# EAGLE design testerusb (EAGLE 9.6.2)
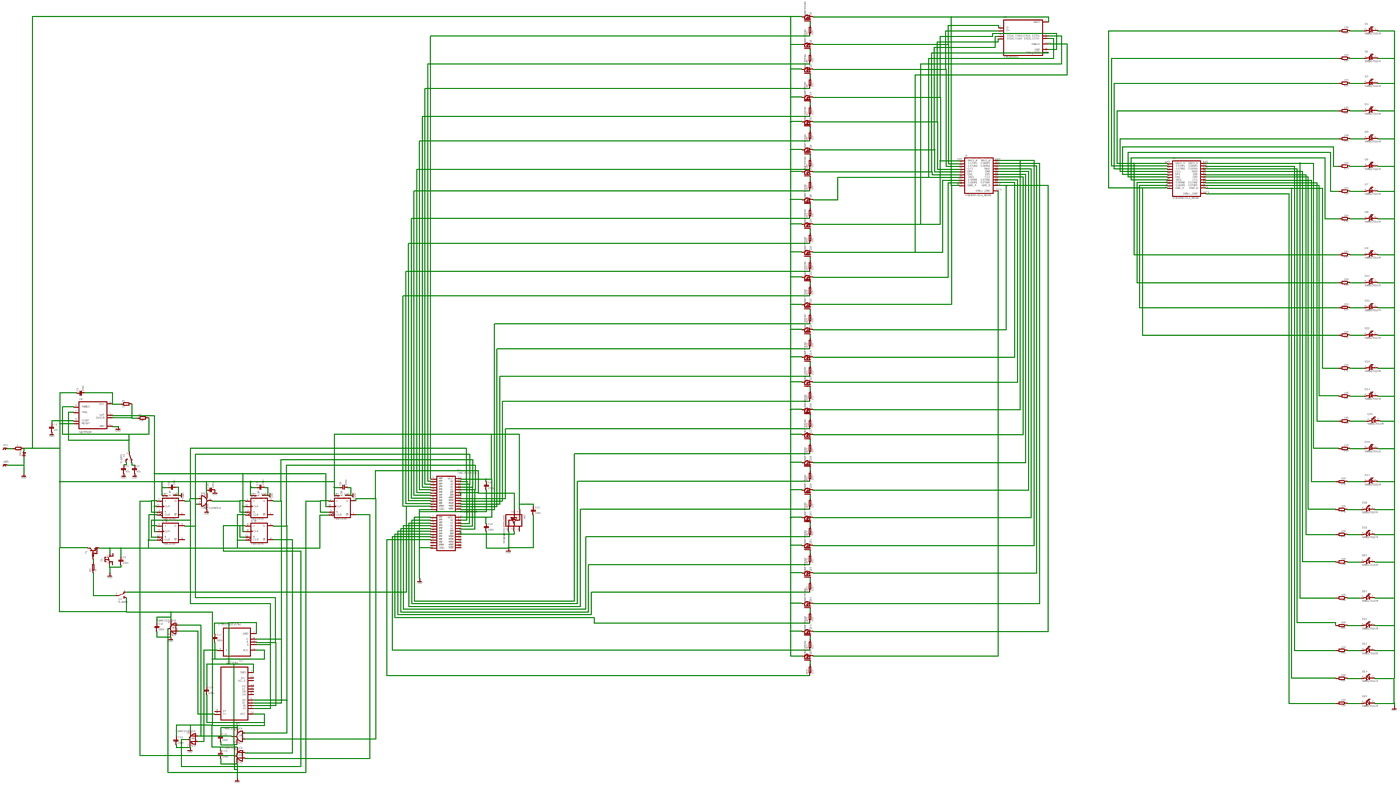
[diagram p0: schematic, sheet 1, overview]
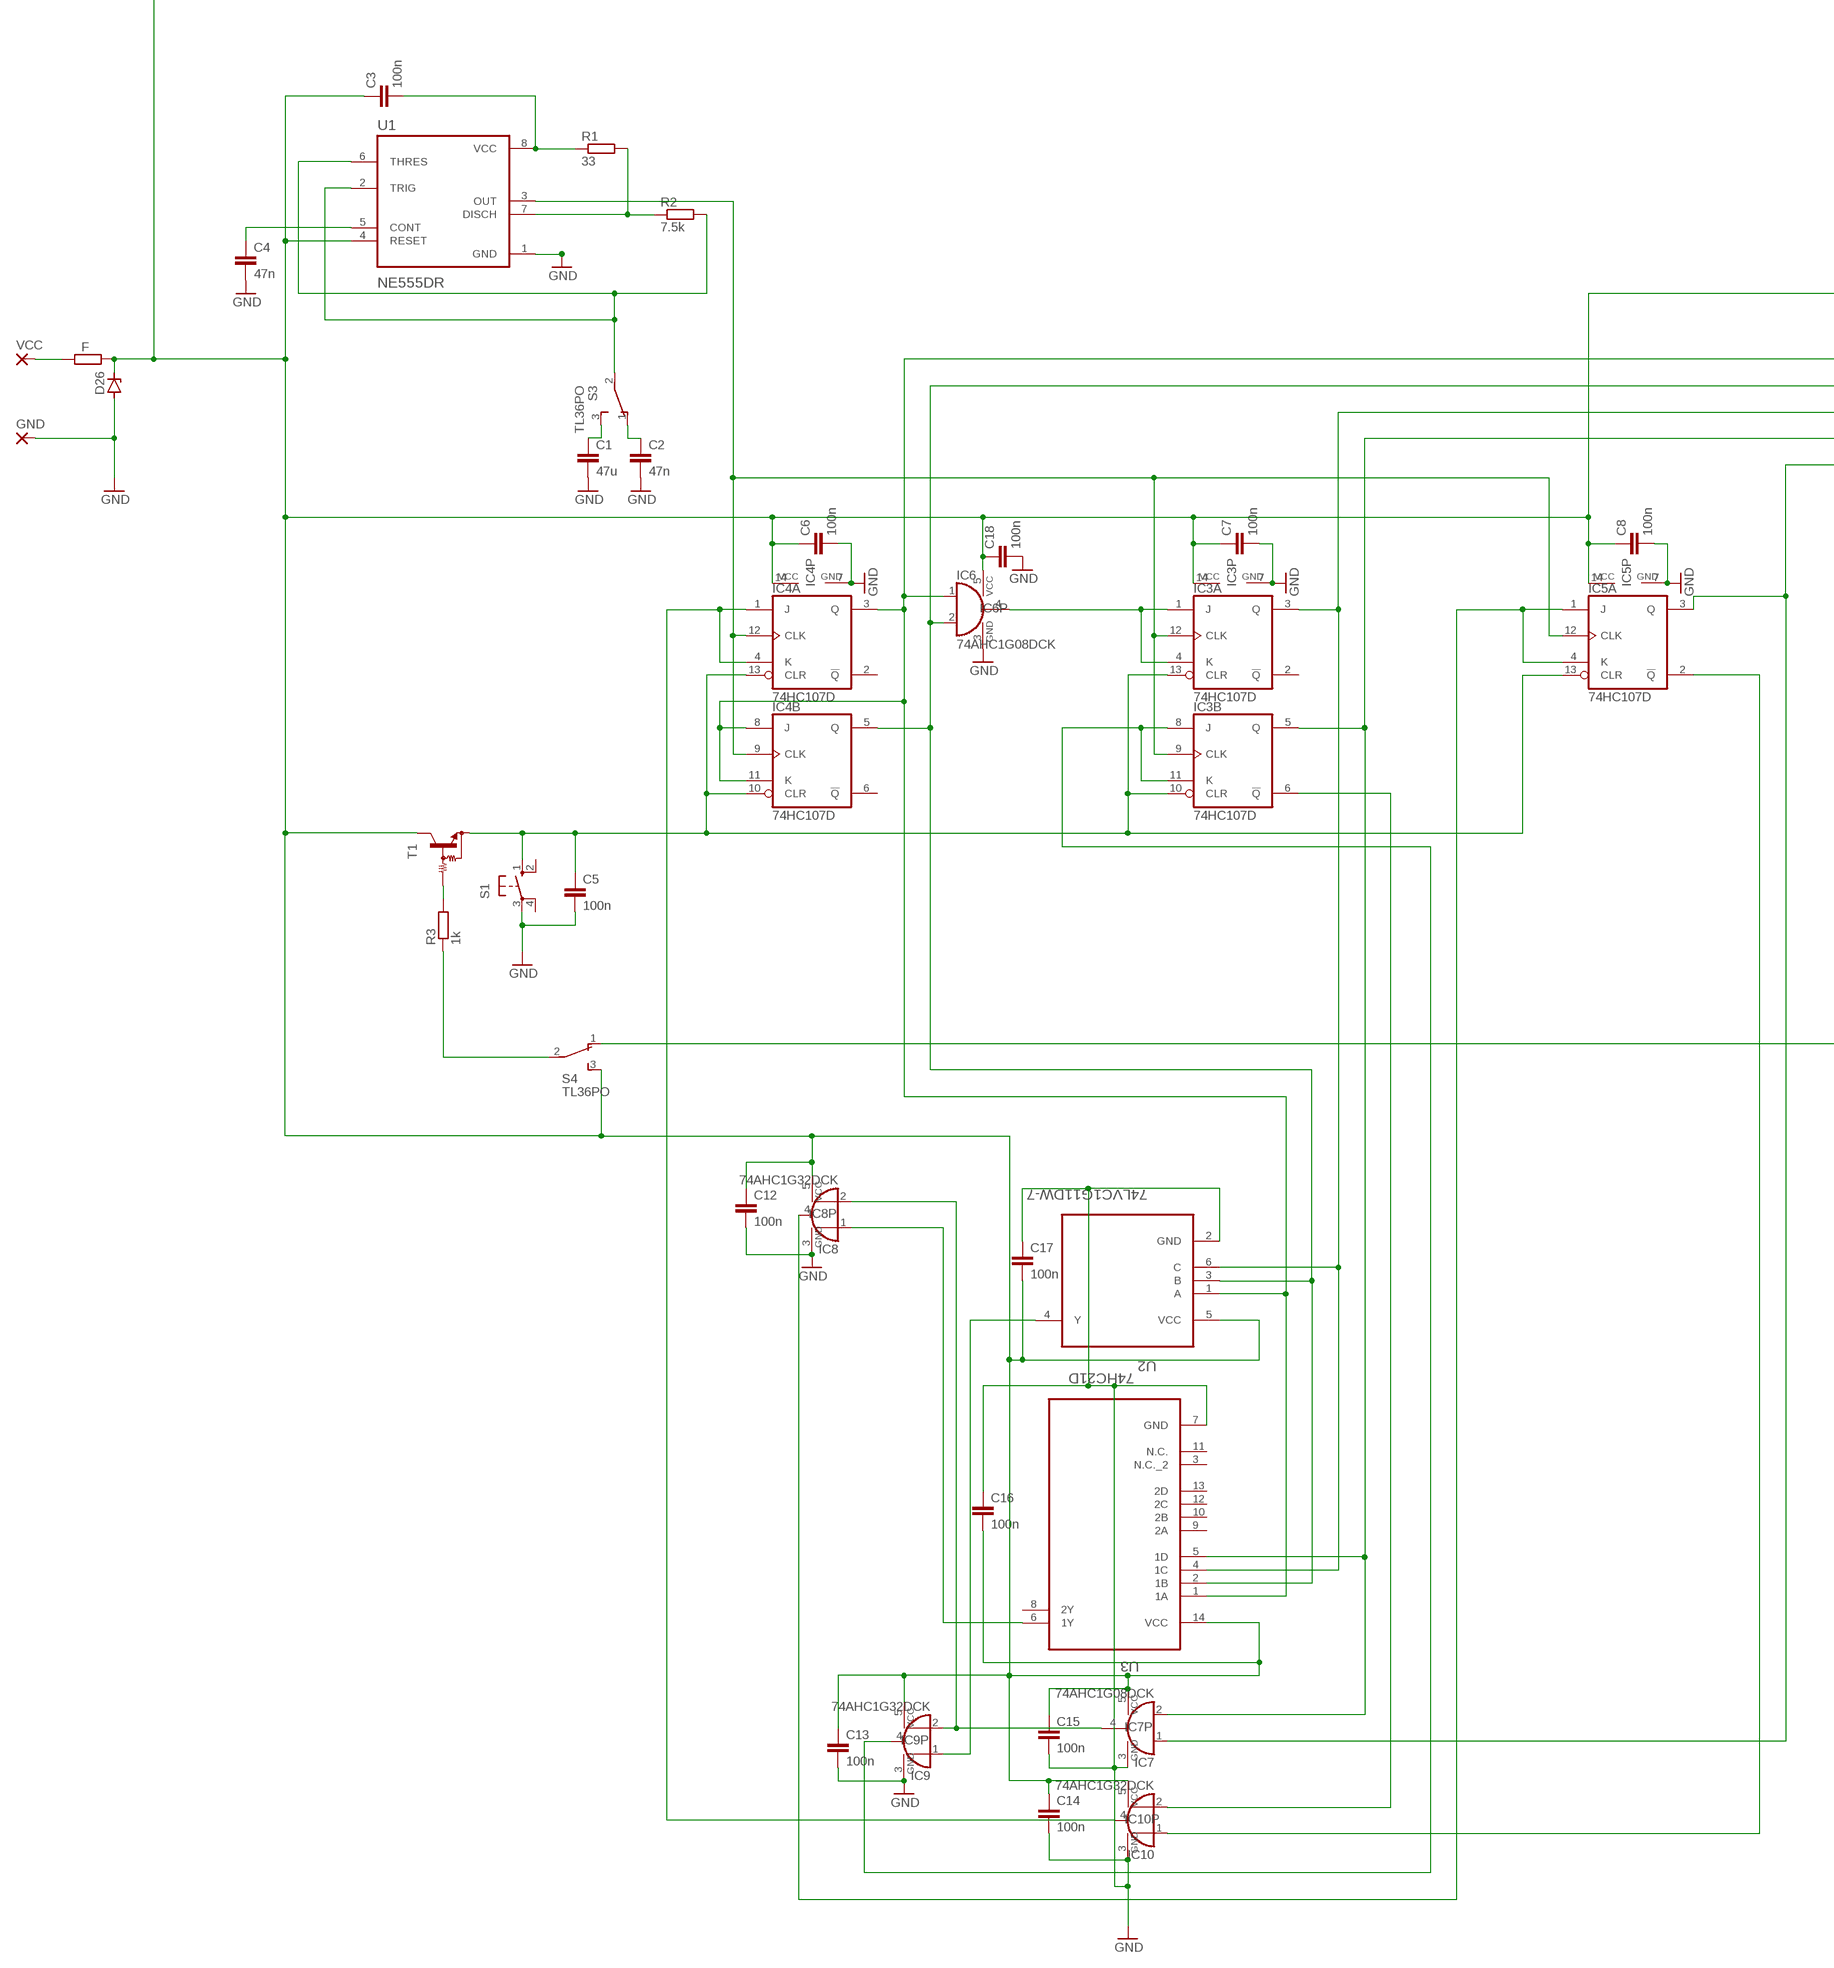
[diagram p1: schematic, sheet 1, part 1 of 6]
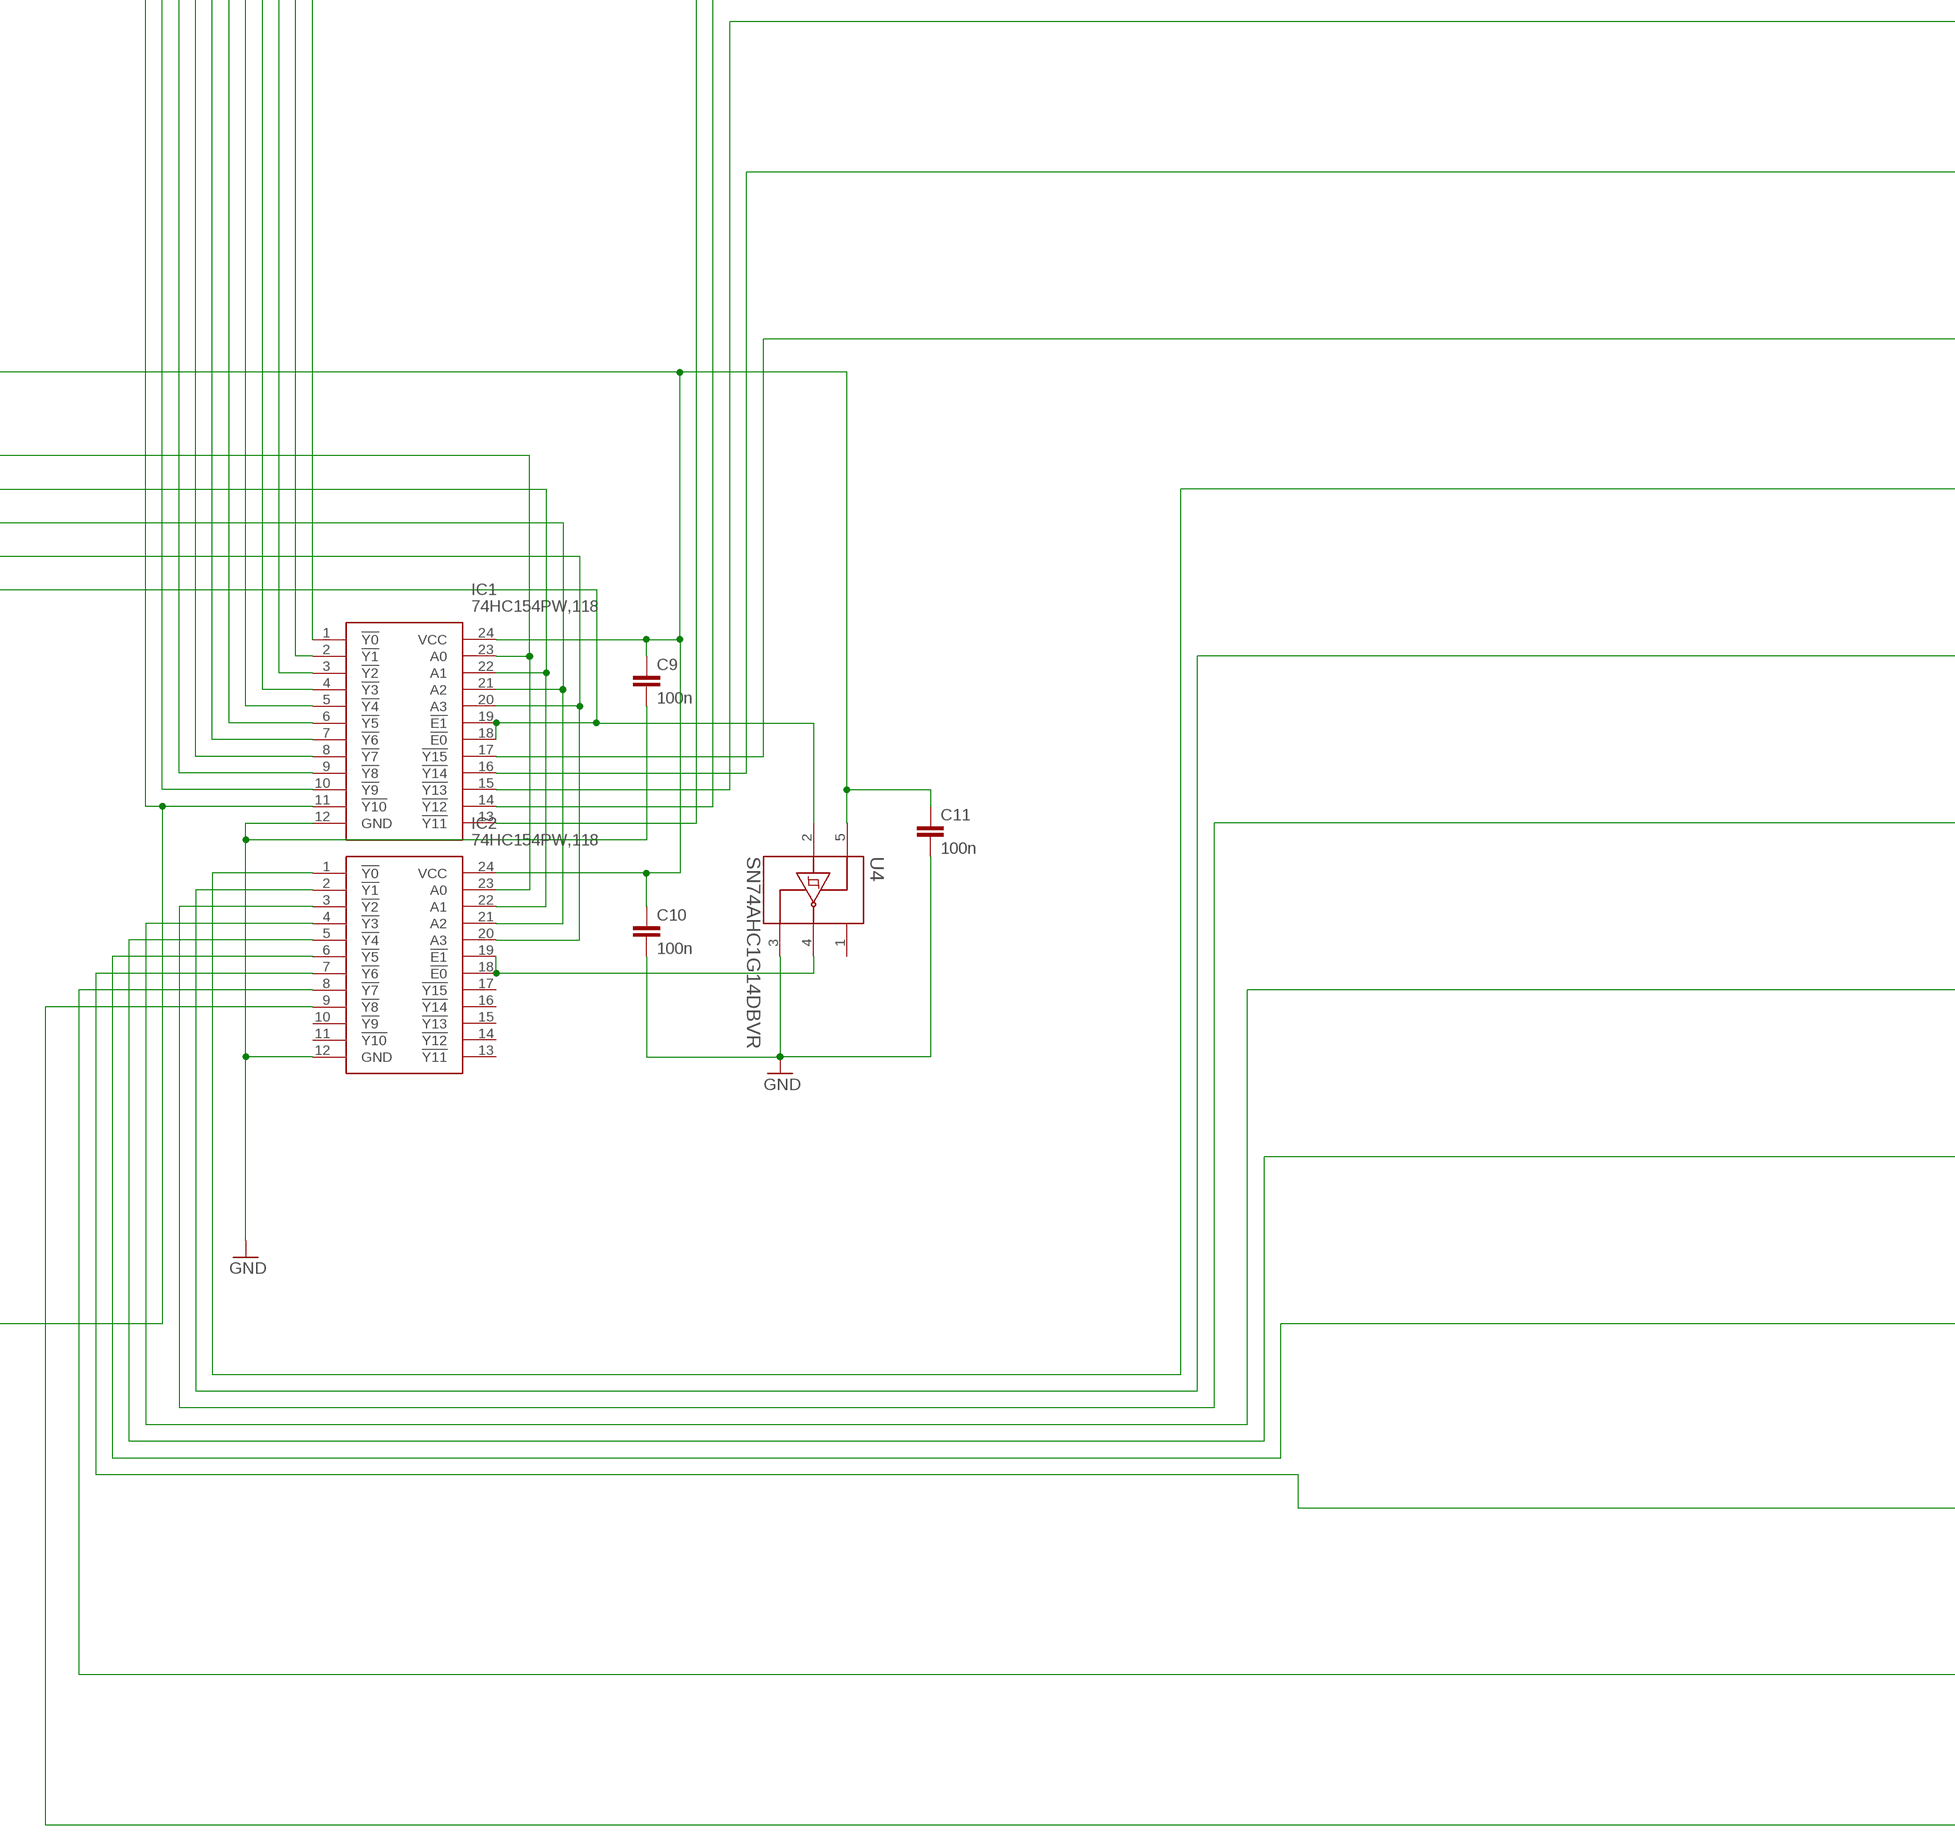
[diagram p2: schematic, sheet 1, part 2 of 6]
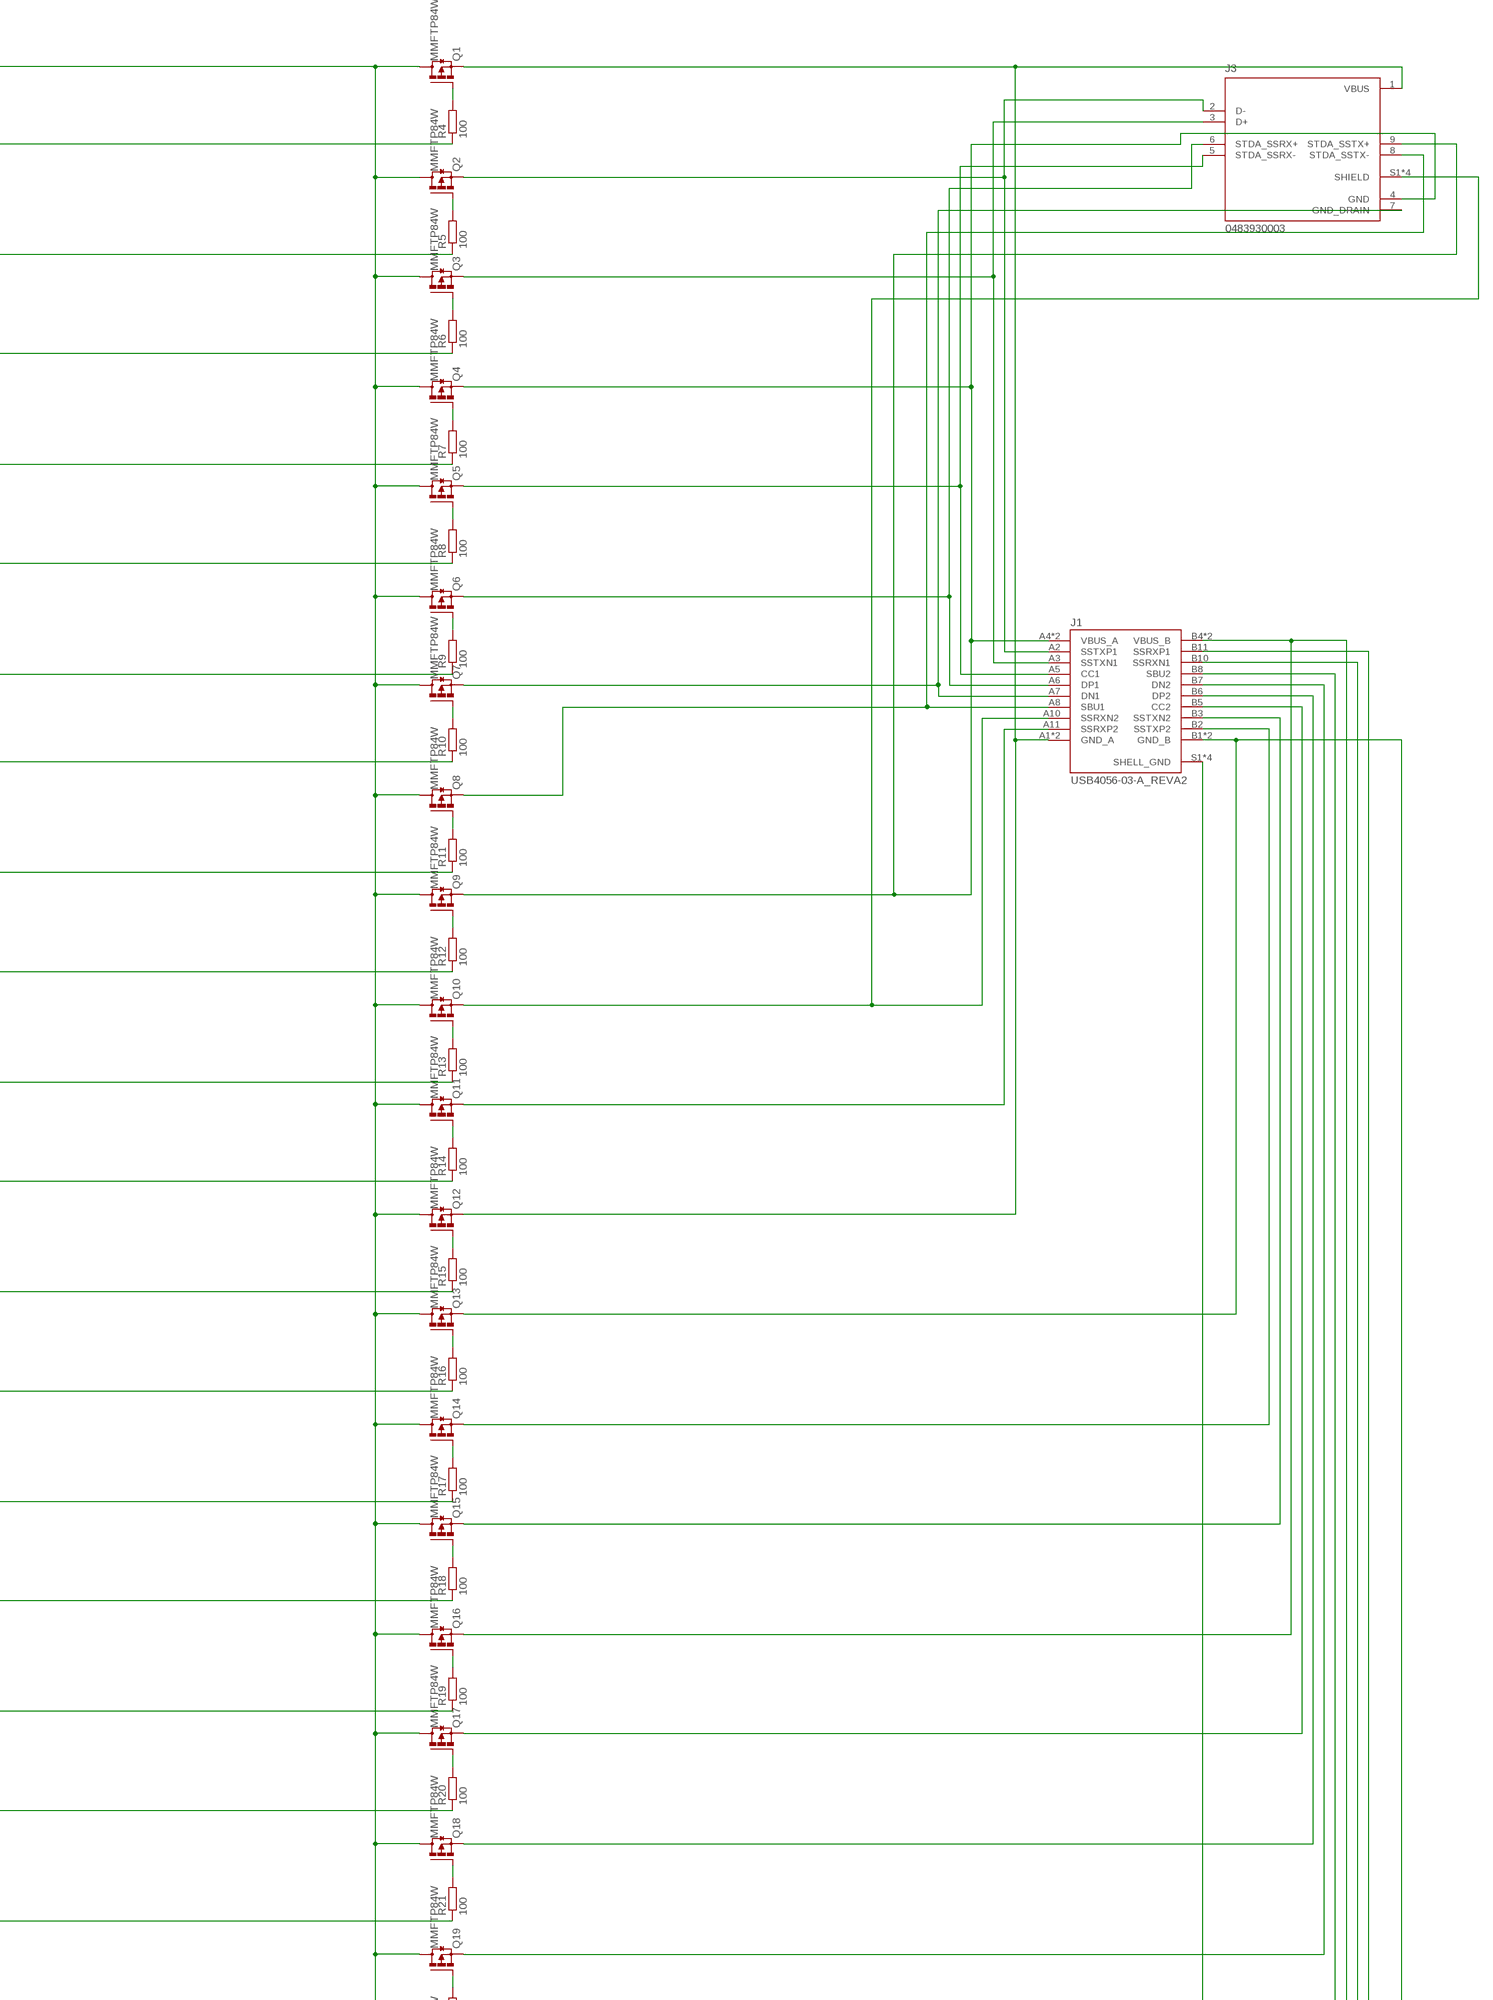
[diagram p3: schematic, sheet 1, part 3 of 6]
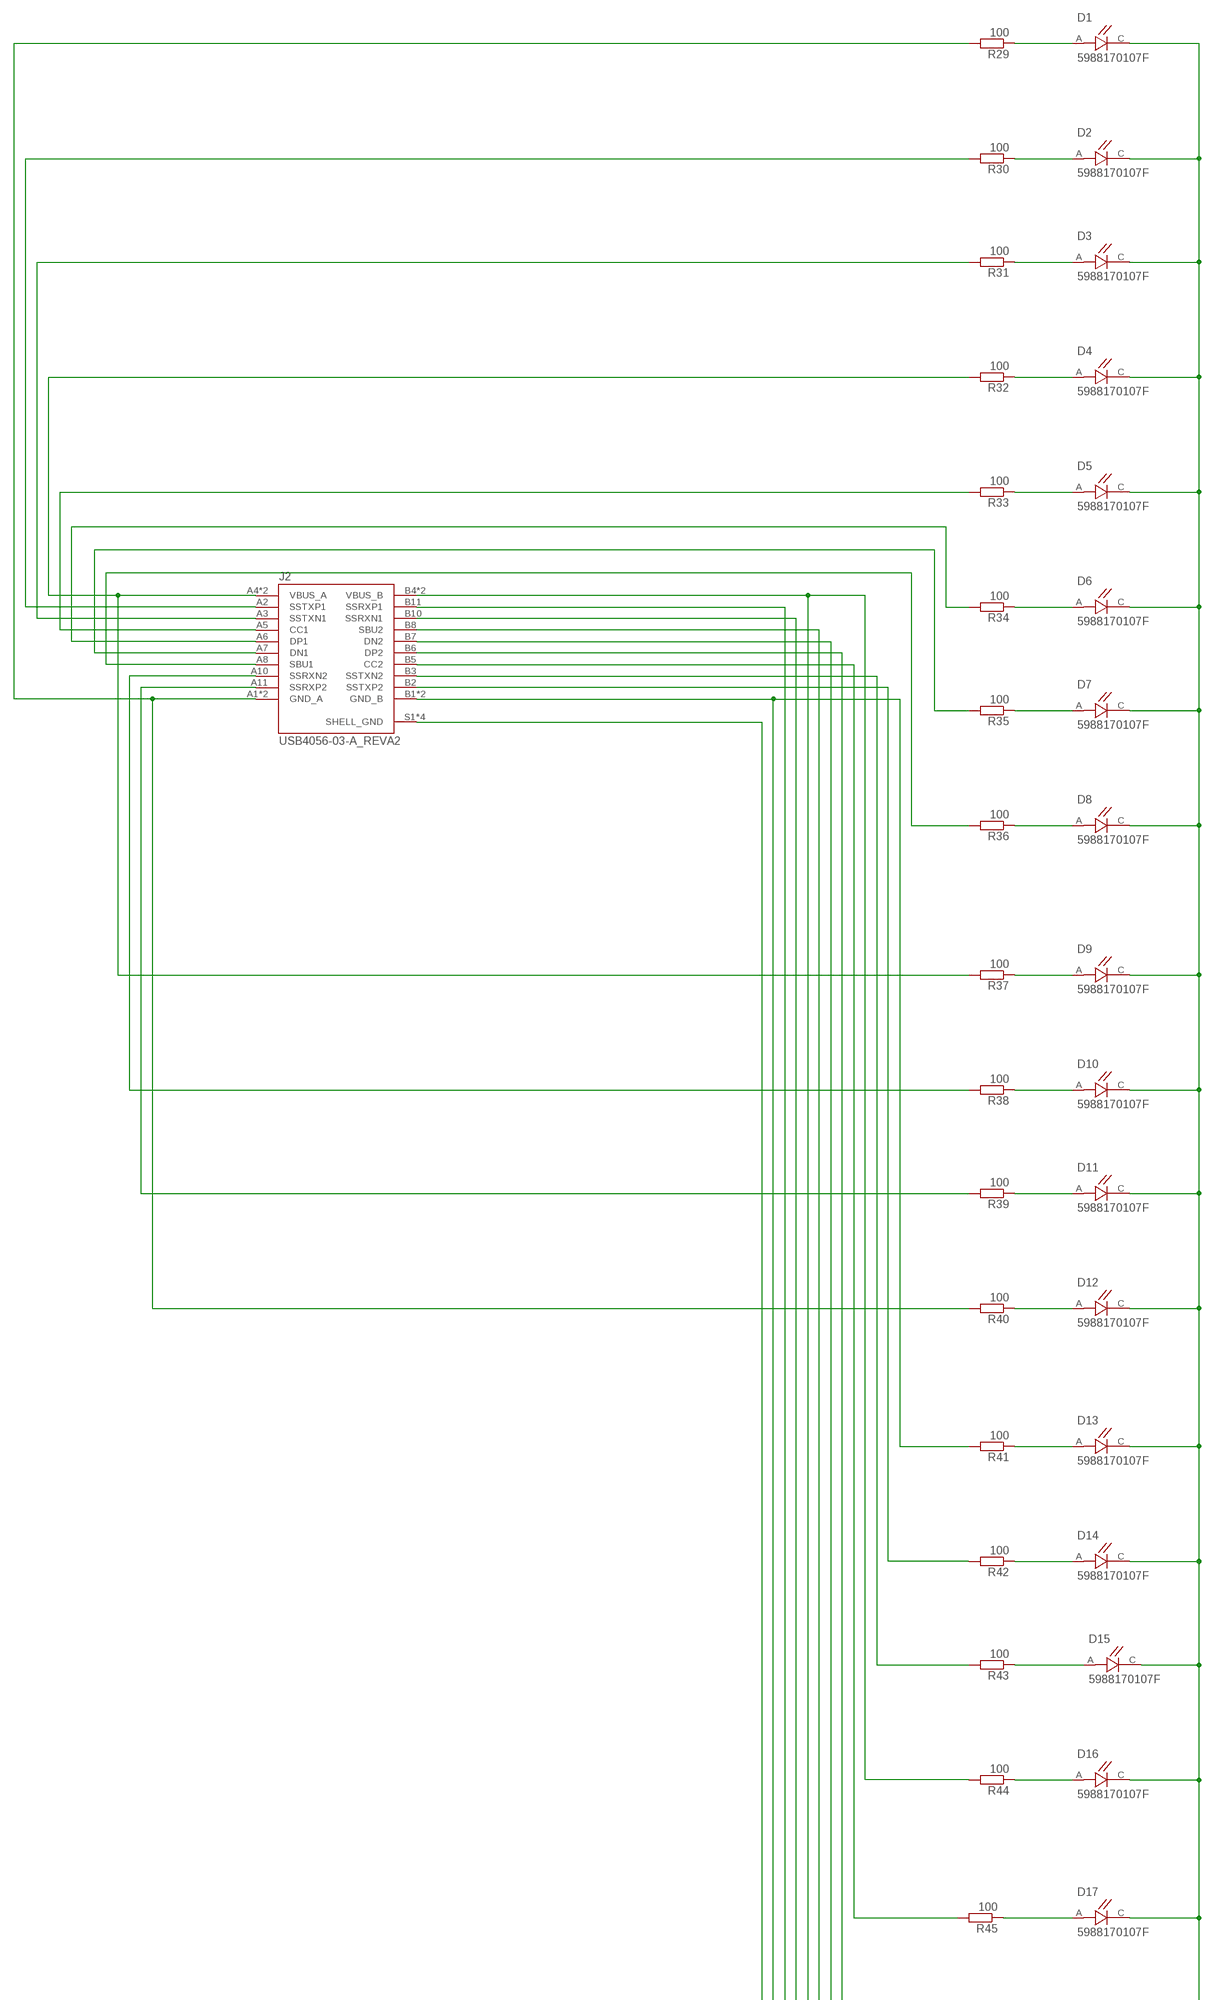
[diagram p4: schematic, sheet 1, part 4 of 6]
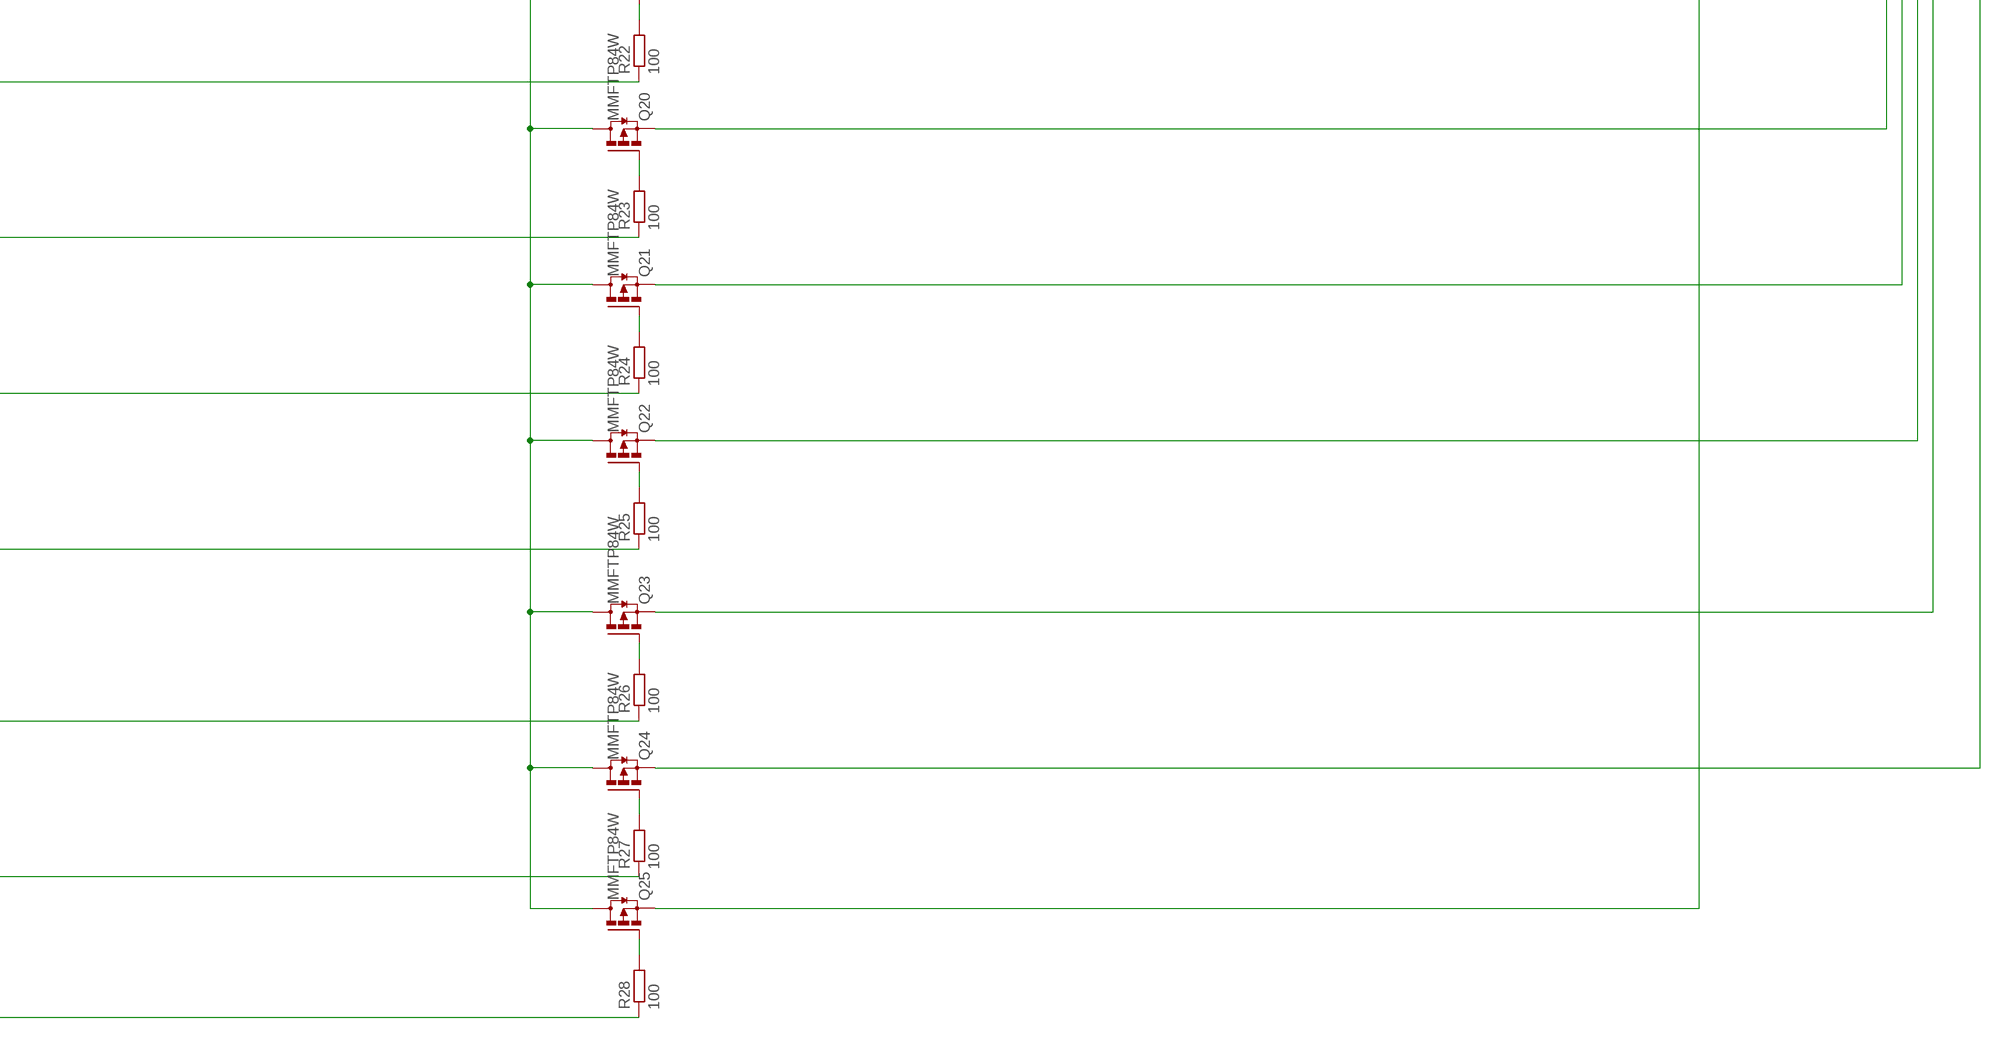
[diagram p5: schematic, sheet 1, part 5 of 6]
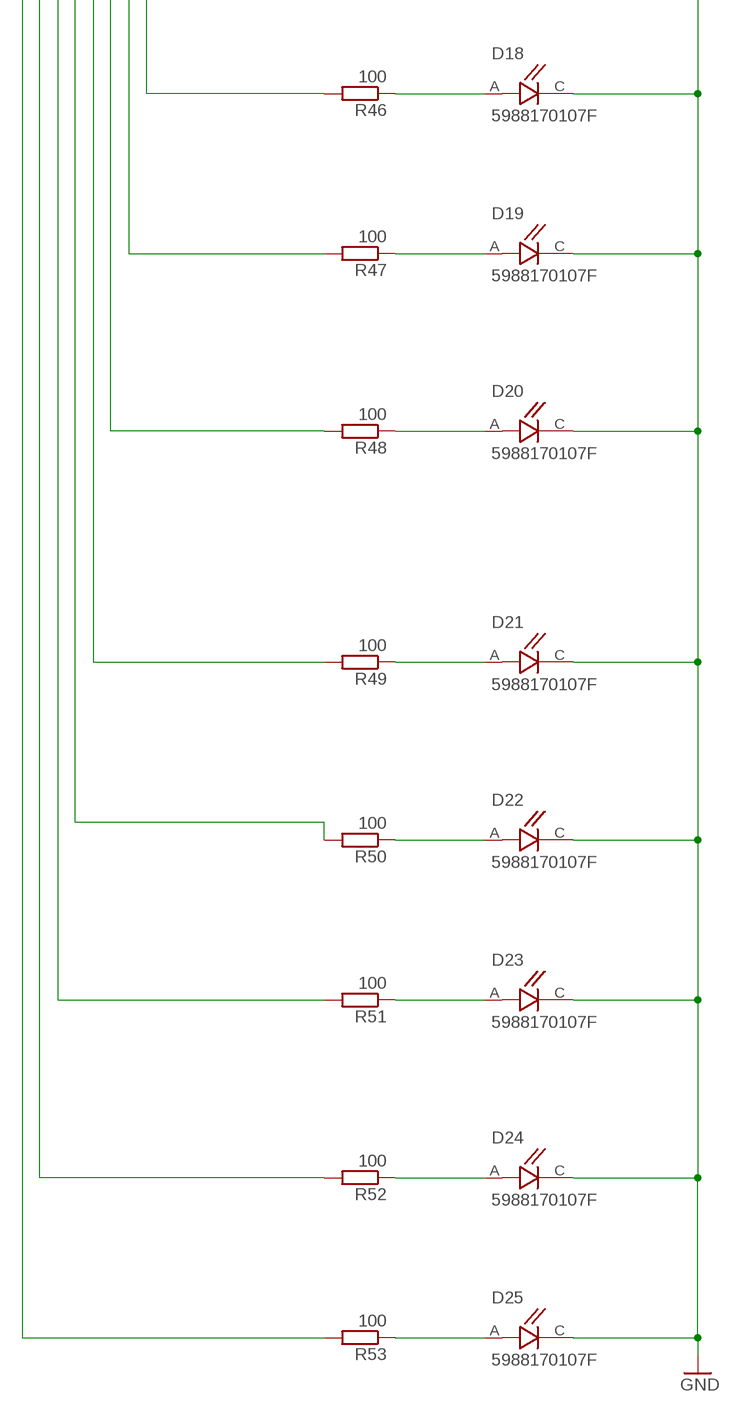
[diagram p6: schematic, sheet 1, part 6 of 6]

## Parts
C1  47u  C-EU025_050-035X075  [C025_050-035X075]
C2  47n  C-EU025_050-035X075  [C025_050-035X075]
C3  100n  C-EUC0805  [C0805]
C4  47n  C-EU025_050-035X075  [C025_050-035X075]
C5  100n  C-EUC0805  [C0805]
C6  100n  C-EUC0805  [C0805]
C7  100n  C-EUC0805  [C0805]
C8  100n  C-EUC0805  [C0805]
C9  100n  C-EUC0805  [C0805]
C10  100n  C-EUC0805  [C0805]
C11  100n  C-EUC0805  [C0805]
C12  100n  C-EUC0805  [C0805]
C13  100n  C-EUC0805  [C0805]
C14  100n  C-EUC0805  [C0805]
C15  100n  C-EUC0805  [C0805]
C16  100n  C-EUC0805  [C0805]
C17  100n  C-EUC0805  [C0805]
C18  100n  C-EUC0805  [C0805]
D1  5988170107F  [LEDC2012X70N]
D2  5988170107F  [LEDC2012X70N]
D3  5988170107F  [LEDC2012X70N]
D4  5988170107F  [LEDC2012X70N]
D5  5988170107F  [LEDC2012X70N]
D6  5988170107F  [LEDC2012X70N]
D7  5988170107F  [LEDC2012X70N]
D8  5988170107F  [LEDC2012X70N]
D9  5988170107F  [LEDC2012X70N]
D10  5988170107F  [LEDC2012X70N]
D11  5988170107F  [LEDC2012X70N]
D12  5988170107F  [LEDC2012X70N]
D13  5988170107F  [LEDC2012X70N]
D14  5988170107F  [LEDC2012X70N]
D15  5988170107F  [LEDC2012X70N]
D16  5988170107F  [LEDC2012X70N]
D17  5988170107F  [LEDC2012X70N]
D18  5988170107F  [LEDC2012X70N]
D19  5988170107F  [LEDC2012X70N]
D20  5988170107F  [LEDC2012X70N]
D21  5988170107F  [LEDC2012X70N]
D22  5988170107F  [LEDC2012X70N]
D23  5988170107F  [LEDC2012X70N]
D24  5988170107F  [LEDC2012X70N]
D25  5988170107F  [LEDC2012X70N]
D26  ZENER-DIODEP1-12  [P1Z12]
F  R-EU_1812X7R  [1812X7R]
GND  3,81/1,4  [3,81/1,4]
IC1  74HC154PW,118  [SOP65P640X110-24N]
IC2  74HC154PW,118  [SOP65P640X110-24N]
IC3  74HC107D  [SO14]
IC4  74HC107D  [SO14]
IC5  74HC107D  [SO14]
IC6  74AHC1G08DCK  [SC70-5]
IC7  74AHC1G08DCK  [SC70-5]
IC8  74AHC1G32DCK  [SC70-5]
IC9  74AHC1G32DCK  [SC70-5]
IC10  74AHC1G32DCK  [SC70-5]
J1  USB4056-03-A_REVA2  [GCT_USB4056-03-A_REVA2]
J2  USB4056-03-A_REVA2  [GCT_USB4056-03-A_REVA2]
J3  0483930003  [MOLEX_0483930003]
Q1  MMFTP84W  FDN360P  [SUPER-SOT3]
Q2  MMFTP84W  FDN360P  [SUPER-SOT3]
Q3  MMFTP84W  FDN360P  [SUPER-SOT3]
Q4  MMFTP84W  FDN360P  [SUPER-SOT3]
Q5  MMFTP84W  FDN360P  [SUPER-SOT3]
Q6  MMFTP84W  FDN360P  [SUPER-SOT3]
Q7  MMFTP84W  FDN360P  [SUPER-SOT3]
Q8  MMFTP84W  FDN360P  [SUPER-SOT3]
Q9  MMFTP84W  FDN360P  [SUPER-SOT3]
Q10  MMFTP84W  FDN360P  [SUPER-SOT3]
Q11  MMFTP84W  FDN360P  [SUPER-SOT3]
Q12  MMFTP84W  FDN360P  [SUPER-SOT3]
Q13  MMFTP84W  FDN360P  [SUPER-SOT3]
Q14  MMFTP84W  FDN360P  [SUPER-SOT3]
Q15  MMFTP84W  FDN360P  [SUPER-SOT3]
Q16  MMFTP84W  FDN360P  [SUPER-SOT3]
Q17  MMFTP84W  FDN360P  [SUPER-SOT3]
Q18  MMFTP84W  FDN360P  [SUPER-SOT3]
Q19  MMFTP84W  FDN360P  [SUPER-SOT3]
Q20  MMFTP84W  FDN360P  [SUPER-SOT3]
Q21  MMFTP84W  FDN360P  [SUPER-SOT3]
Q22  MMFTP84W  FDN360P  [SUPER-SOT3]
Q23  MMFTP84W  FDN360P  [SUPER-SOT3]
Q24  MMFTP84W  FDN360P  [SUPER-SOT3]
Q25  MMFTP84W  FDN360P  [SUPER-SOT3]
R1  33  R-EU_0207/10  [0207/10]
R2  7.5k  R-EU_0207/10  [0207/10]
R3  1k  R-EU_R0805  [R0805]
R4  100  R-EU_R0805  [R0805]
R5  100  R-EU_R0805  [R0805]
R6  100  R-EU_R0805  [R0805]
R7  100  R-EU_R0805  [R0805]
R8  100  R-EU_R0805  [R0805]
R9  100  R-EU_R0805  [R0805]
R10  100  R-EU_R0805  [R0805]
R11  100  R-EU_R0805  [R0805]
R12  100  R-EU_R0805  [R0805]
R13  100  R-EU_R0805  [R0805]
R14  100  R-EU_R0805  [R0805]
R15  100  R-EU_R0805  [R0805]
R16  100  R-EU_R0805  [R0805]
R17  100  R-EU_R0805  [R0805]
R18  100  R-EU_R0805  [R0805]
R19  100  R-EU_R0805  [R0805]
R20  100  R-EU_R0805  [R0805]
R21  100  R-EU_R0805  [R0805]
R22  100  R-EU_R0805  [R0805]
R23  100  R-EU_R0805  [R0805]
R24  100  R-EU_R0805  [R0805]
R25  100  R-EU_R0805  [R0805]
R26  100  R-EU_R0805  [R0805]
R27  100  R-EU_R0805  [R0805]
R28  100  R-EU_R0805  [R0805]
R29  100  R-EU_R0805  [R0805]
R30  100  R-EU_R0805  [R0805]
R31  100  R-EU_R0805  [R0805]
R32  100  R-EU_R0805  [R0805]
R33  100  R-EU_R0805  [R0805]
R34  100  R-EU_R0805  [R0805]
R35  100  R-EU_R0805  [R0805]
R36  100  R-EU_R0805  [R0805]
R37  100  R-EU_R0805  [R0805]
R38  100  R-EU_R0805  [R0805]
R39  100  R-EU_R0805  [R0805]
R40  100  R-EU_R0805  [R0805]
R41  100  R-EU_R0805  [R0805]
R42  100  R-EU_R0805  [R0805]
R43  100  R-EU_R0805  [R0805]
R44  100  R-EU_R0805  [R0805]
R45  100  R-EU_R0805  [R0805]
R46  100  R-EU_R0805  [R0805]
R47  100  R-EU_R0805  [R0805]
R48  100  R-EU_R0805  [R0805]
R49  100  R-EU_R0805  [R0805]
R50  100  R-EU_R0805  [R0805]
R51  100  R-EU_R0805  [R0805]
R52  100  R-EU_R0805  [R0805]
R53  100  R-EU_R0805  [R0805]
S1  10-XX  [B3F-10XX]
S3  TL36PO  [TL3XPO]
S4  TL36PO  [TL3XPO]
T1  MUN2211T1-NPN_DRIVER-SC59-BEC  [SC59-BEC]
U1  NE555DR  [SOIC127P599X175-8N]
U2  74LVC1G11DW-7  [SOT65P210X110-6N]
U3  74HC21D  [SOIC127P600X175-14N]
U4  SN74AHC1G14DBVR  [SOT95P280X145-5N]
VCC  3,81/1,4  [3,81/1,4]

## Nets
GND: C1.2 C2.2 C4.2 C5.2 C6.2 C7.2 C8.2 C9.2 C10.2 C11.2 C12.2 C13.2 C14.2 C15.2 C16.1 C17.1 C18.2 D1.C D2.C D3.C D4.C D5.C D6.C D7.C D8.C D9.C D10.C D11.C D12.C D13.C D14.C D15.C D16.C D17.C D18.C D19.C D20.C D21.C D22.C D23.C D24.C D25.C D26.A GND.1(P) IC1.12(GND) IC2.12(GND) IC3.7(P:GND) IC4.7(P:GND) IC5.7(P:GND) IC6.3(GND) IC7.3(GND) IC8.3(GND) IC9.3(GND) IC10.3(GND) S1.3(P) U1.1(GND) U2.2(GND) U3.7(GND) U4.3(GND)
N$1: Q1.1(G) R4.2
N$2: Q2.1(G) R5.2
N$3: IC4.1(A:J) IC4.4(A:K) IC10.4(O)
N$4: IC1.18(!E0) IC1.19(!E1) IC5.3(A:Q) IC7.1(I0) U4.2(A)
N$5: IC3.1(A:J) IC3.4(A:K) IC6.4(O)
N$6: IC3.8(B:J) IC3.11(B:K) IC9.4(O)
N$7: IC5.1(A:J) IC5.4(A:K) IC8.4(O)
N$8: F.1 VCC.1(P)
N$9: C1.1 S3.3(S)
N$10: C3.2 R1.1 U1.8(VCC)
N$11: C3.1 C6.1 C7.1 C8.1 C9.1 C10.1 C11.1 C12.1 C13.1 C14.1 C15.1 C16.2 C17.2 C18.1 D26.C F.2 IC1.24(VCC) IC2.24(VCC) IC3.14(P:VCC) IC4.14(P:VCC) IC5.14(P:VCC) IC6.5(VCC) IC7.5(VCC) IC8.5(VCC) IC9.5(VCC) IC10.5(VCC) Q1.3(D) Q2.3(D) Q3.3(D) Q4.3(D) Q5.3(D) Q6.3(D) Q7.3(D) Q8.3(D) Q9.3(D) Q10.3(D) Q11.3(D) Q12.3(D) Q13.3(D) Q14.3(D) Q15.3(D) Q16.3(D) Q17.3(D) Q18.3(D) Q19.3(D) Q20.3(D) Q21.3(D) Q22.3(D) Q23.3(D) Q24.3(D) Q25.3(D) S4.3(S) T1.C U1.4(RESET) U2.5(VCC) U3.14(VCC) U4.5(VCC)
N$12: R1.2 R2.1 U1.7(DISCH)
N$13: C4.1 U1.5(CONT)
N$14: C2.1 S3.1(O)
N$15: R2.2 S3.2(P) U1.2(TRIG) U1.6(THRES)
N$16: IC3.9(B:CLK) IC3.12(A:CLK) IC4.9(B:CLK) IC4.12(A:CLK) IC5.12(A:CLK) U1.3(OUT)
N$17: R3.2 T1.B
N$18: C5.1 IC3.10(B:CLR) IC3.13(A:CLR) IC4.10(B:CLR) IC4.13(A:CLR) IC5.13(A:CLR) S1.1(S) T1.E
N$20: IC1.2(!Y1) R5.1
N$21: R3.1 S4.2(P)
N$22: IC1.11(!Y10) R14.1 S4.1(O)
N$23: IC3.6(B:!Q) IC10.2(I1)
N$24: IC1.22(A1) IC2.22(A1) IC4.5(B:Q) IC6.2(I1) U2.3(B) U3.2(1B)
N$25: IC1.23(A0) IC2.23(A0) IC4.3(A:Q) IC4.8(B:J) IC4.11(B:K) IC6.1(I0) U2.1(A) U3.1(1A)
N$26: IC2.18(!E0) IC2.19(!E1) U4.4(Y)
N$27: IC5.2(A:!Q) IC10.1(I0)
N$28: IC7.4(O) IC8.2(I1) IC9.2(I1)
N$29: IC9.1(I0) U2.4(Y)
N$30: IC1.21(A2) IC2.21(A2) IC3.3(A:Q) U2.6(C) U3.4(1C)
N$31: IC1.20(A3) IC2.20(A3) IC3.5(B:Q) IC7.2(I1) U3.5(1D)
N$32: IC8.1(I0) U3.6(1Y)
N$33: IC1.1(!Y0) R4.1
N$34: IC1.3(!Y2) R6.1
N$35: IC1.4(!Y3) R7.1
N$36: IC1.5(!Y4) R8.1
N$37: IC1.6(!Y5) R9.1
N$38: IC1.7(!Y6) R10.1
N$39: IC1.8(!Y7) R11.1
N$40: IC1.9(!Y8) R12.1
N$41: IC1.10(!Y9) R13.1
N$42: IC1.13(!Y11) R15.1
N$43: IC1.14(!Y12) R16.1
N$44: IC1.15(!Y13) R17.1
N$45: IC1.16(!Y14) R18.1
N$46: IC1.17(!Y15) R19.1
N$47: IC2.1(!Y0) R20.1
N$48: IC2.9(!Y8) R28.1
N$49: IC2.2(!Y1) R21.1
N$50: IC2.3(!Y2) R22.1
N$51: IC2.4(!Y3) R23.1
N$52: IC2.5(!Y4) R24.1
N$53: IC2.6(!Y5) R25.1
N$54: IC2.7(!Y6) R26.1
N$55: IC2.8(!Y7) R27.1
N$56: Q3.1(G) R6.2
N$57: Q4.1(G) R7.2
N$58: Q5.1(G) R8.2
N$59: Q6.1(G) R9.2
N$60: Q7.1(G) R10.2
N$61: Q8.1(G) R11.2
N$62: Q9.1(G) R12.2
N$63: Q10.1(G) R13.2
N$64: Q11.1(G) R14.2
N$65: Q12.1(G) R15.2
N$66: Q13.1(G) R16.2
N$67: Q14.1(G) R17.2
N$68: Q15.1(G) R18.2
N$69: Q16.1(G) R19.2
N$70: Q17.1(G) R20.2
N$71: Q18.1(G) R21.2
N$72: Q19.1(G) R22.2
N$73: Q20.1(G) R23.2
N$74: Q21.1(G) R24.2
N$75: Q22.1(G) R25.2
N$76: Q23.1(G) R26.2
N$77: Q24.1(G) R27.2
N$78: Q25.1(G) R28.2
N$80: D1.A R29.1
N$81: J1.A1(GND_A) J1.A12(GND_A) J3.1(VBUS) Q1.2(S) Q12.2(S)
N$82 [New Class]: J1.B1(GND_B) J1.B12(GND_B) Q13.2(S) Q24.2(S)
N$83: J1.A2(SSTXP1) J3.2(D-) Q2.2(S)
N$84: J1.A3(SSTXN1) J3.3(D+) Q3.2(S)
N$85: J1.A4(VBUS_A) J1.A9(VBUS_A) J3.4(GND) J3.9(STDA_SSTX+) Q4.2(S) Q9.2(S)
N$86: J1.A5(CC1) J3.5(STDA_SSRX-) Q5.2(S)
N$87: J1.A6(DP1) J3.6(STDA_SSRX+) Q6.2(S)
N$88: J1.A7(DN1) J3.7(GND_DRAIN) Q7.2(S)
N$89: J1.A8(SBU1) J3.8(STDA_SSTX-) Q8.2(S)
N$90: J1.A10(SSRXN2) J3.S1(SHIELD) J3.S2(SHIELD) J3.S3(SHIELD) J3.S4(SHIELD) Q10.2(S)
N$91: J1.A11(SSRXP2) Q11.2(S)
N$92: J1.B2(SSTXP2) Q14.2(S)
N$93: J1.B3(SSTXN2) Q15.2(S)
N$94: J1.B4(VBUS_B) J1.B9(VBUS_B) Q16.2(S) Q21.2(S)
N$95: J1.B5(CC2) Q17.2(S)
N$96: J1.B6(DP2) Q18.2(S)
N$97: J1.B7(DN2) Q19.2(S)
N$98: J1.B8(SBU2) Q20.2(S)
N$99: D2.A R30.1
N$100: J1.B10(SSRXN1) Q22.2(S)
N$101: J1.B11(SSRXP1) Q23.2(S)
N$102: D3.A R31.1
N$103: J1.S1(SHELL_GND) J1.S2(SHELL_GND) J1.S3(SHELL_GND) J1.S4(SHELL_GND) Q25.2(S)
N$104: D4.A R32.1
N$105: D5.A R33.1
N$106: D6.A R34.1
N$107: D7.A R35.1
N$108: D8.A R36.1
N$109: D9.A R37.1
N$110: D10.A R38.1
N$111: D11.A R39.1
N$112: D12.A R40.1
N$113: D13.A R41.1
N$114: D14.A R42.1
N$115: D15.A R43.1
N$116: D16.A R44.1
N$117: D17.A R45.1
N$118: D18.A R46.1
N$119: D19.A R47.1
N$120: D20.A R48.1
N$121: D21.A R49.1
N$122: D22.A R50.1
N$123: D23.A R51.1
N$124: D24.A R52.1
N$125: D25.A R53.1
N$126: J2.A1(GND_A) J2.A12(GND_A) R29.2 R40.2
N$127: J2.A2(SSTXP1) R30.2
N$128: J2.A3(SSTXN1) R31.2
N$129: J2.A4(VBUS_A) J2.A9(VBUS_A) R32.2 R37.2
N$130: J2.A5(CC1) R33.2
N$131: J2.A6(DP1) R34.2
N$132: J2.A7(DN1) R35.2
N$133: J2.A8(SBU1) R36.2
N$134: J2.A10(SSRXN2) R38.2
N$135: J2.A11(SSRXP2) R39.2
N$136: J2.B1(GND_B) J2.B12(GND_B) R41.2 R52.2
N$137: J2.B2(SSTXP2) R42.2
N$138: J2.B3(SSTXN2) R43.2
N$139: J2.B4(VBUS_B) J2.B9(VBUS_B) R44.2 R49.2
N$140: J2.B5(CC2) R45.2
N$141: J2.B6(DP2) R46.2
N$142: J2.B7(DN2) R47.2
N$143: J2.B8(SBU2) R48.2
N$144: J2.B10(SSRXN1) R50.2
N$145: J2.B11(SSRXP1) R51.2
N$146: J2.S1(SHELL_GND) J2.S2(SHELL_GND) J2.S3(SHELL_GND) J2.S4(SHELL_GND) R53.2
Unconnected: IC2.10(!Y9) IC2.11(!Y10) IC2.13(!Y11) IC2.14(!Y12) IC2.15(!Y13) IC2.16(!Y14) IC2.17(!Y15) IC3.2(A:!Q) IC4.2(A:!Q) IC4.6(B:!Q) IC5.5(B:Q) IC5.6(B:!Q) IC5.8(B:J) IC5.9(B:CLK) IC5.10(B:CLR) IC5.11(B:K) S1.2(S1) S1.4(P1) U3.3(N.C._2) U3.8(2Y) U3.9(2A) U3.10(2B) U3.11(N.C.) U3.12(2C) U3.13(2D) U4.1(NC)

## Library data of the parts
C1-C18 = rcl:C-EU: CAPACITOR, European symbol; SPICEPREFIX: C
D1-D25 = 5988170107F:5988170107F: Standard LEDs - SMD Green Water Clr 40mcd 570nm Check availability <https://pricing.snapeda.com/parts/5988170107F/Dialight/view-part?ref=eda>; AVAILABILITY: In Stock; DESCRIPTION: Green 566nm LED Indication - Discrete 2V 0805 (2012 Metric); MF: Dialight; MP: 5988170107F; PACKAGE: 0805 Dialight; PRICE: None; PURCHASE-URL: https://pricing.snapeda.com/search/part/5988170107F/?ref=eda
D26 = diode:ZENER-DIODE: Z-Diode
F R1-R53 = rcl:R-EU_: RESISTOR, European symbol; SPICEPREFIX: R
GND VCC = wirepad:3,81/1,4: THROUGH-HOLE PAD
IC1 IC2 = 74HC154PW_118:74HC154PW,118: Encoders, Decoders, Multiplexers & Demultiplexers 4-16 DECODER/DEMUX Source: Datasheet <https://assets.nexperia.com/documents/data-sheet/74HC_HCT154.pdf>; ARROW_PART_NUMBER: 74HC154PW,118; ARROW_PRICE-STOCK: https://www.arrow.com/en/products/74hc154pw118/nexperia?region=nac; DESCRIPTION: Encoders, Decoders, Multiplexers & Demultiplexers 4-16 DECODER/DEMUX; HEIGHT: 1.1mm; MANUFACTURER_NAME: Nexperia; MANUFACTURER_PART_NUMBER: 74HC154PW,118; MOUSER_PART_NUMBER: 771-HC154PW118; MOUSER_PRICE-STOCK: https://www.mouser.co.uk/ProductDetail/Nexperia/74HC154PW118?qs=P62ublwmbi9%252BzQcGRVZVsg%3D%3D
IC3-IC5 = 74xx-eu:74*107: Dual J-K FLIP FLOP, clear
IC6 IC7 = 74xx-little-de:74*1G08: 2-input AND gate
IC8-IC10 = 74xx-little-de:74*1G32: 2-input OR gate
J1 J2 = USB4056-03-A_REVA2:USB4056-03-A_REVA2: Check availability <https://pricing.snapeda.com/parts/USB4056-03-A/Global%20Connector%20Technology/view-part?ref=eda>; AVAILABILITY: In Stock; DESCRIPTION: USB-C (USB TYPE-C) USB 3.2 Gen 2 (USB 3.1 Gen 2, Superspeed + (USB 3.1)) Receptacle Connector 24 Position Surface Mount, Right Angle; Through Hole; MF: Global Connector Technology; MP: USB4056-03-A; PACKAGE: None; PRICE: None
J3 = 0483930003:0483930003: Usb Rec 4p Ra Type a 15au Check availability <https://pricing.snapeda.com/parts/0483930003/Molex/view-part?ref=eda>; AVAILABILITY: In Stock; DESCRIPTION: USB-A (USB TYPE-A) USB 3.2 Gen 1 (USB 3.1 Gen 1, Superspeed (USB 3.0)) Receptacle Connector 9 Position Through Hole, Right Angle; MF: Molex; MP: 0483930003; PACKAGE: None; PRICE: None; PURCHASE-URL: https://pricing.snapeda.com/search/part/0483930003/?ref=eda
Q1-Q25 = transistor-power:FDN360P: Single P-Channel, PowerTrench (R) MOSFET Source: http://www.fairchildsemi.com/ds/FD/FDN360P.pdf
S1 = switch-omron:10-XX: OMRON SWITCH; MPN: B3F-1000; OC_FARNELL: 176432; OC_NEWARK: 36M3542
S3 S4 = switch:TL36PO: TINY SWITCH ON - ON Source: http://www2.produktinfo.conrad.com/datenblaetter/700000-724999/705152-da-01-de-Subminiaturschalter_TL_36YO.pdf
T1 = transistor:*-NPN_DRIVER-: NPN Bias Resistor Transistor
U1 = NE555DR:NE555DR: None Check availability <https://pricing.snapeda.com/parts/NE555DR/Texas%20Instruments/view-part?ref=eda>; AVAILABILITY: In Stock; DESCRIPTION: Single Precision Timer; MF: Texas Instruments; MP: NE555DR; PACKAGE: SOIC-8 Texas Instruments; PRICE: None; PURCHASE-URL: https://pricing.snapeda.com/search/part/NE555DR/?ref=eda
U2 = 74LVC1G11DW-7:74LVC1G11DW-7: SINGLE 3 INPUT POSITIVE AND GATE Check availability <https://pricing.snapeda.com/parts/74LVC1G11DW-7/Diodes%20Inc./view-part?ref=eda>; AVAILABILITY: In Stock; DESCRIPTION: AND Gate IC 1 Channel - SOT-363; MF: Diodes Inc.; MP: 74LVC1G11DW-7; PACKAGE: SOT-363 Diodes Inc.; PRICE: None; PURCHASE-URL: https://pricing.snapeda.com/search/part/74LVC1G11DW-7/?ref=eda
U3 = 74HC21D:74HC21D: Dual 4-input AND gate Check availability <https://pricing.snapeda.com/parts/74HC21D/Toshiba/view-part?ref=eda>; AVAILABILITY: In Stock; DESCRIPTION: AND Gate IC 2 Channel - 14-SOIC; MF: Toshiba; MP: 74HC21D; PACKAGE: SOIC-14 NXP Semiconductors; PRICE: None; PURCHASE-URL: https://pricing.snapeda.com/search/part/74HC21D/?ref=eda
U4 = SN74AHC1G14DBVR:SN74AHC1G14DBVR: Single Schmitt-Trigger Inverter Gate 5-SOT-23 -40 to 125 Check availability <https://pricing.snapeda.com/parts/SN74AHC1G14DBVR/Texas%20Instruments/view-part?ref=eda>; AVAILABILITY: In Stock; DESCRIPTION: Single 2-V to 5.5-V inverter with Schmitt-Trigger inputs; MF: Texas Instruments; MP: SN74AHC1G14DBVR; PACKAGE: SOT-23-5 Texas Instruments; PRICE: None; PURCHASE-URL: https://pricing.snapeda.com/search/part/SN74AHC1G14DBVR/?ref=eda

## Board
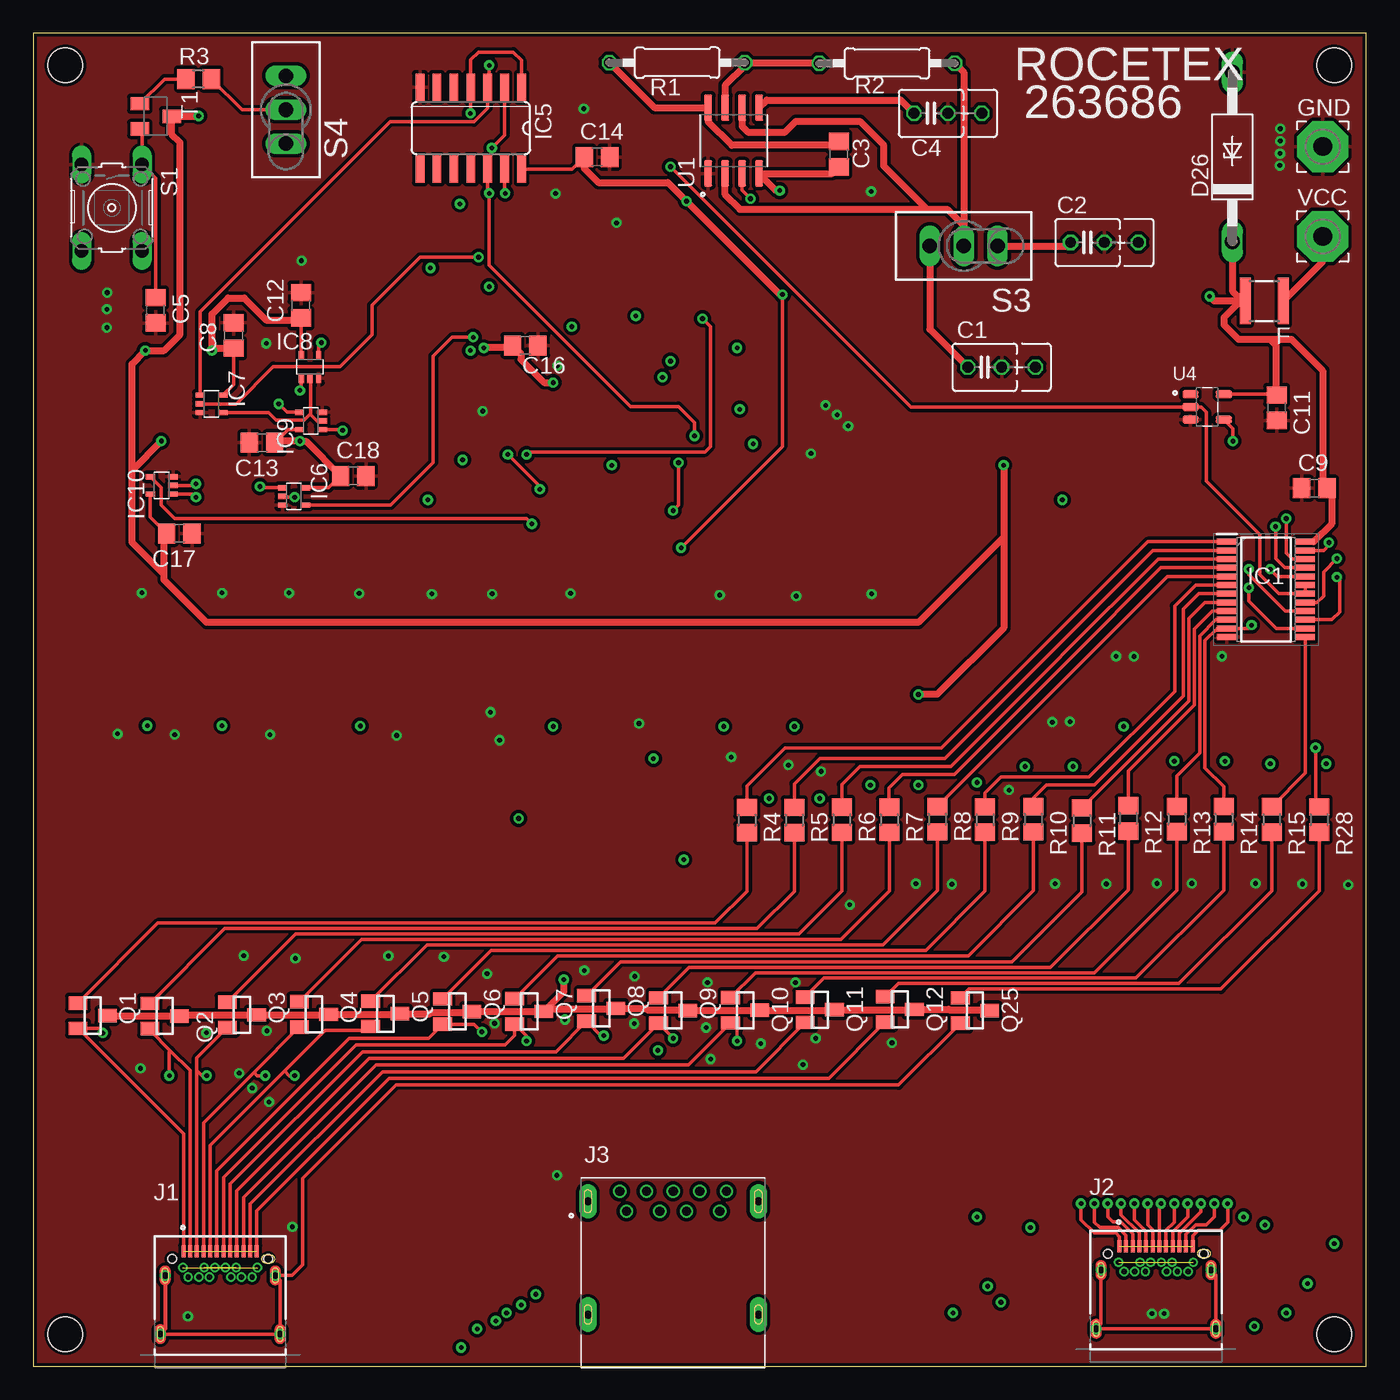
[diagram p7: board, top side]
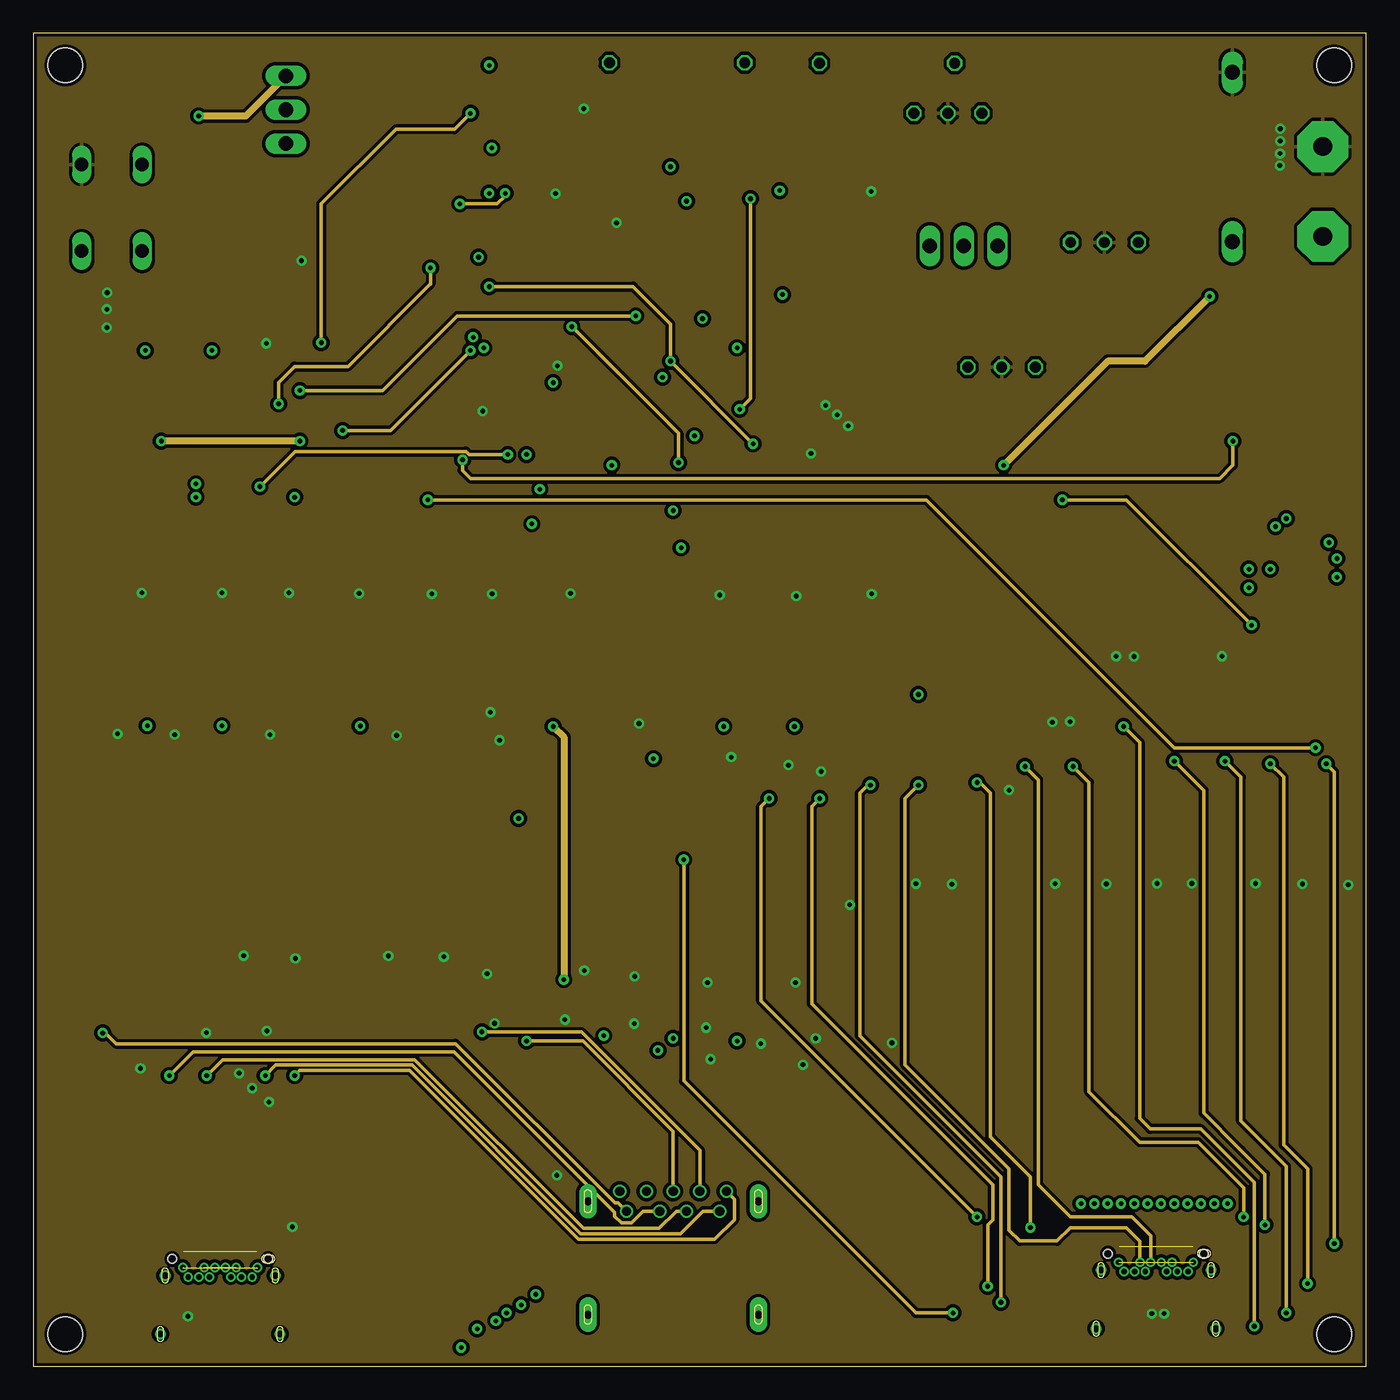
[diagram p8: board, inner layer Route2]
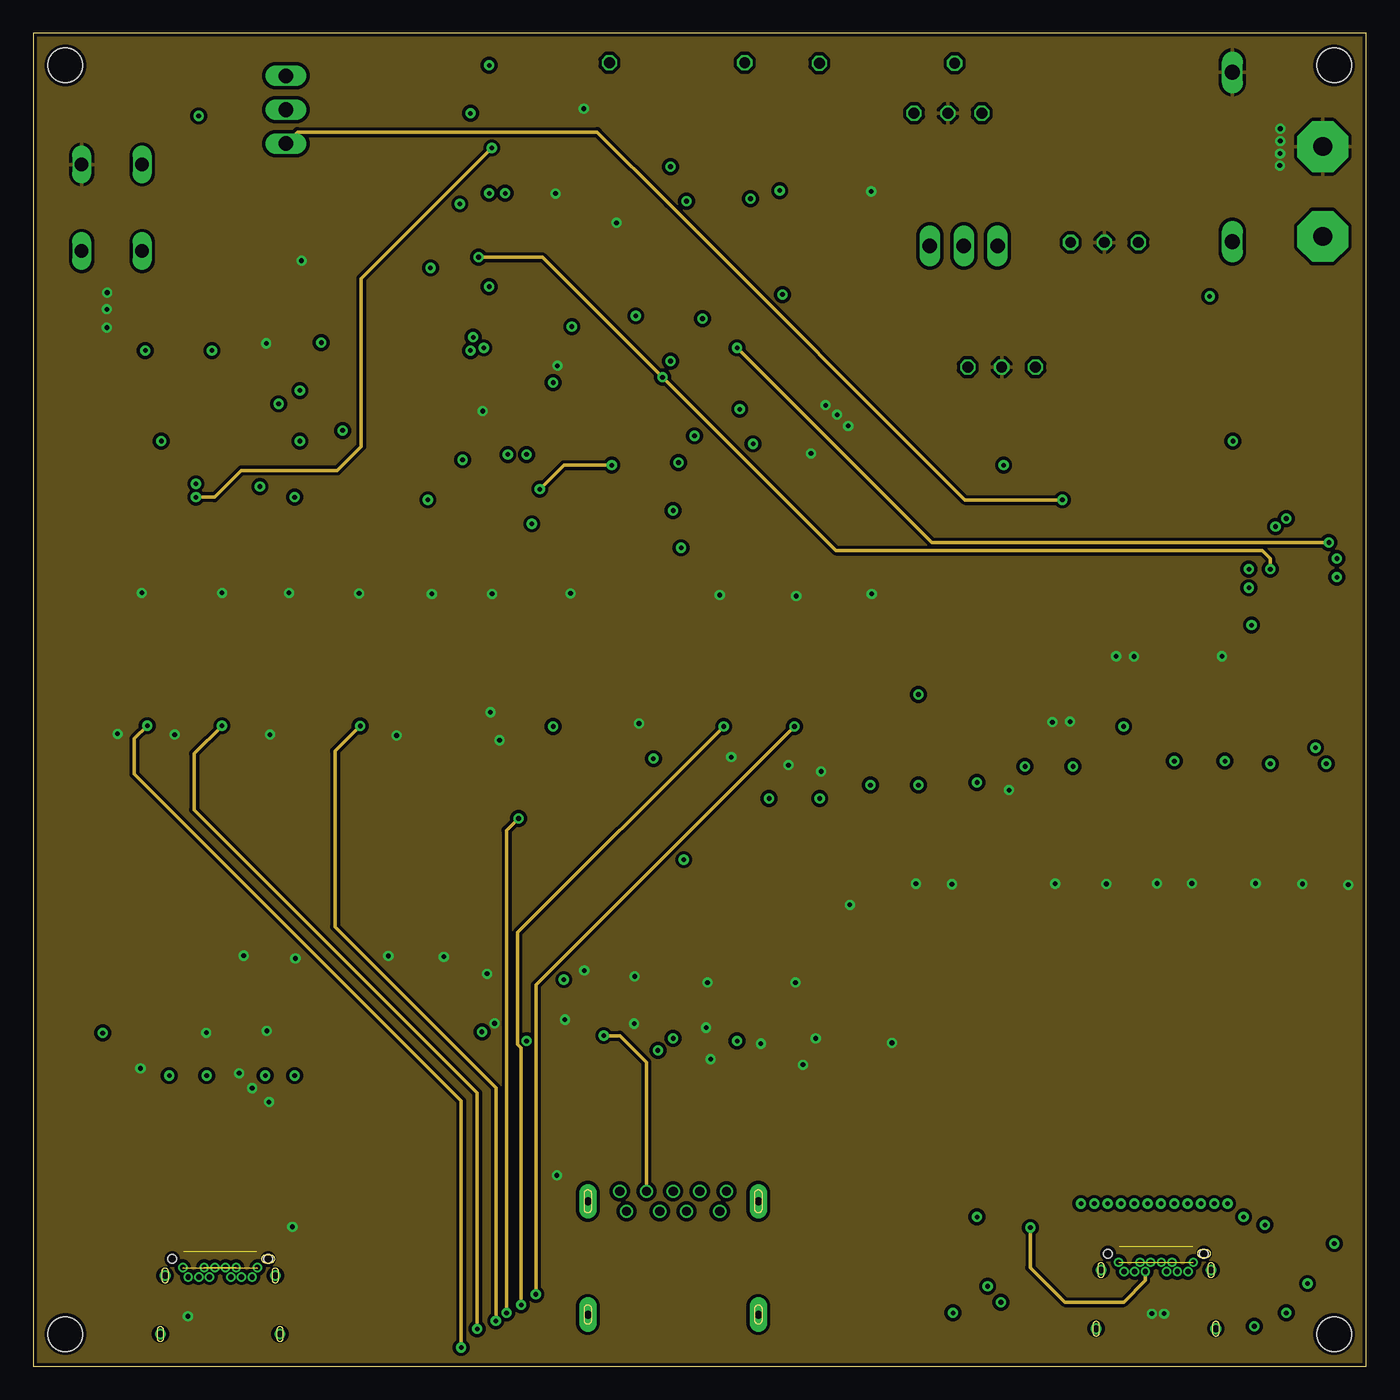
[diagram p9: board, inner layer Route15]
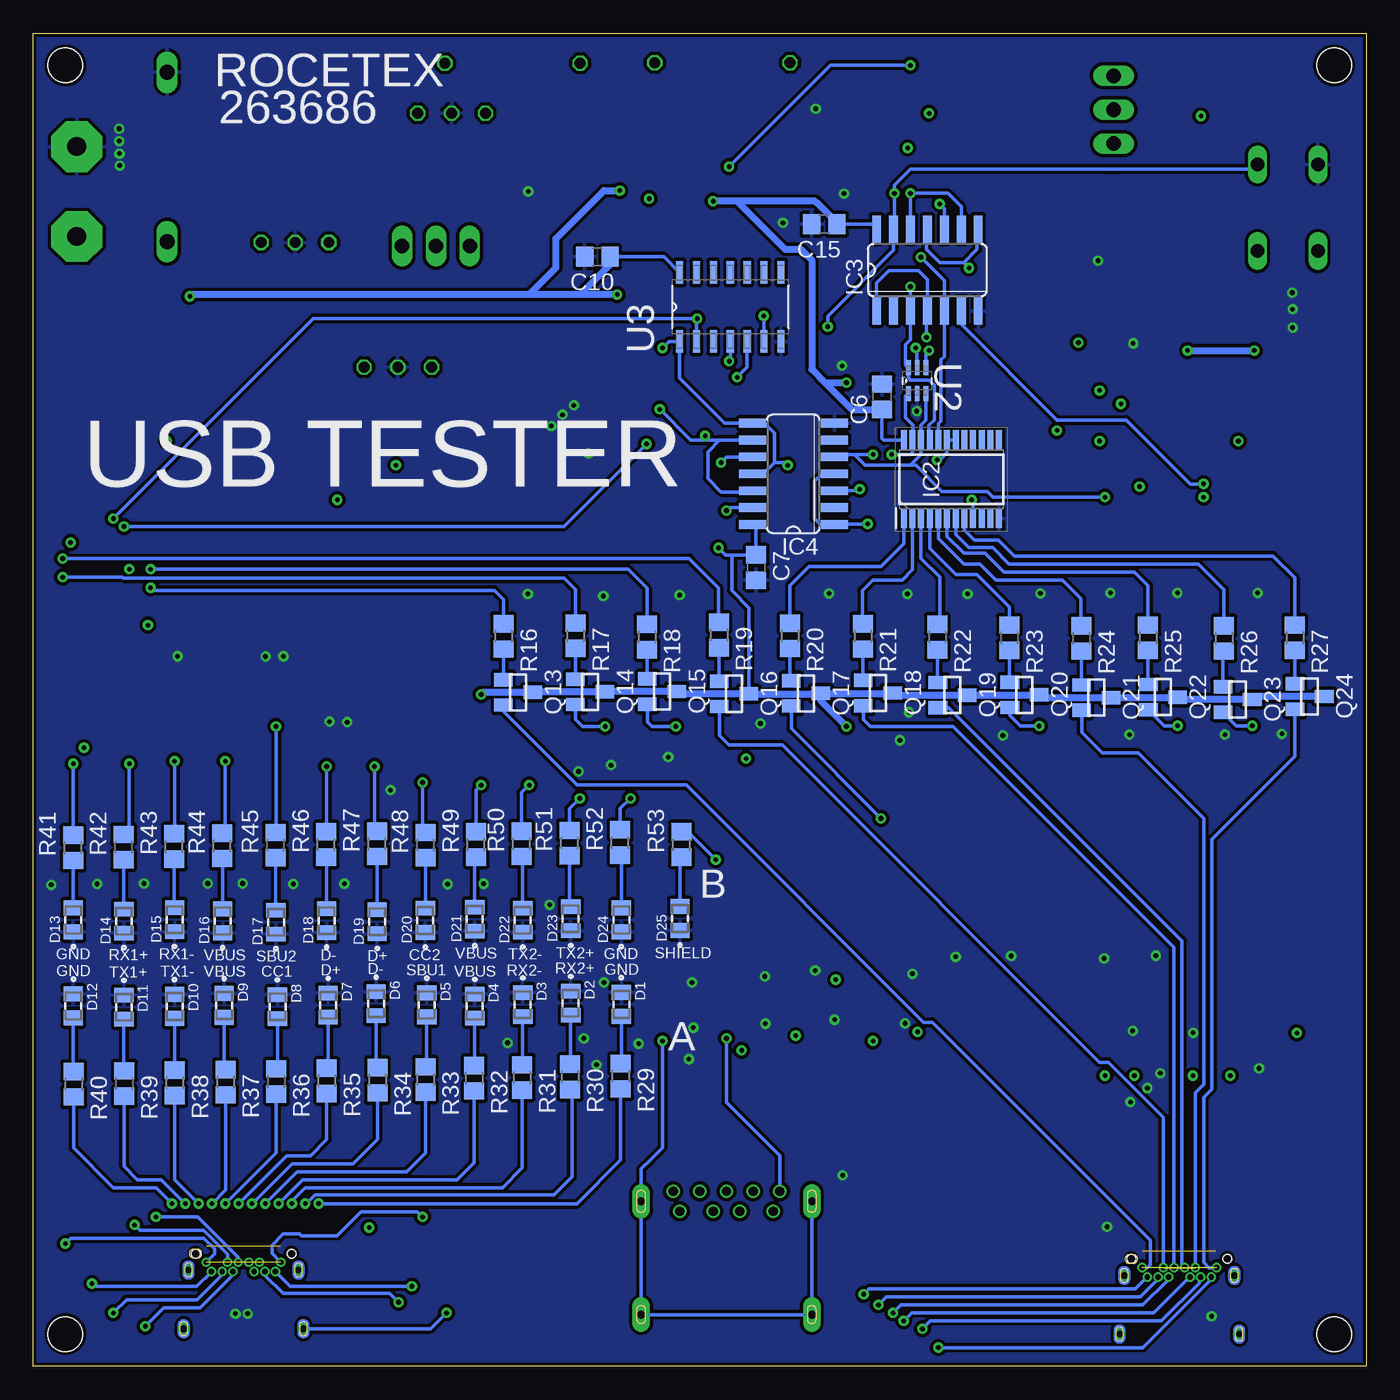
[diagram p10: board, bottom side, seen from below]

Size 100 x 100 mm. Coordinates in mm from the lower left corner, seen from the top.
Outline: 0,0 100,0 100,100 0,100 0,0
Copper layers (1+2*15+16): Top 0.035mm / dielectric 0.15mm / Route2 0.035mm / dielectric 1.5mm / Route15 0.035mm / dielectric 0.2mm / Bottom 0.035mm
Design rules "default *": minimum track width 6mil, minimum drill 0.35mm, track to track 5mil, track to pad 5mil, pad to pad 5mil, via to via 5mil, smd to smd 5mil, copper to edge 0.25mm, drill to drill 6mil, minimum pad ring 0.15mm, minimum via ring 8mil, stop-mask expansion 4mil, vias tented up to drill 0mil, thermal gap 10mil
Holes 2.6 mm at 2.4,97.6 2.4,2.4 97.6,2.4 97.6,97.6

### Footprints (pad centres in the part's own frame; a part is rotated, then mirrored left to right if it is on the bottom)
C025_050-035X075 = drill 0.813 octagon: 1 -1.27,0; 2 1.27,0; 3 3.81,0
C0805 = smd 1.3 x 1.5: 1 -0.95,0; 2 0.95,0
LEDC2012X70N = smd 1.1 x 1.45: A 0.9,0; C -0.9,0
P1Z12 = drill 1.118 long: A 6.35,0; C -6.35,0
1812X7R = smd 0.8 x 3.5: 1 -1.425,0; 2 1.425,0
3,81/1,4 = drill 1.397 pad 3.81 octagon: 1 0,0
SOP65P640X110-24N = smd 1.475 x 0.45: 1 -2.938,3.575; 2 -2.938,2.925; 3 -2.938,2.275; 4 -2.938,1.625; 5 -2.938,0.975; 6 -2.938,0.325; 7 -2.938,-0.325; 8 -2.938,-0.975; 9 -2.938,-1.625; 10 -2.938,-2.275; 11 -2.938,-2.925; 12 -2.938,-3.575; 13 2.938,-3.575; 14 2.938,-2.925; 15 2.938,-2.275; 16 2.938,-1.625; 17 2.938,-0.975; 18 2.938,-0.325; 19 2.938,0.325; 20 2.938,0.975; 21 2.938,1.625; 22 2.938,2.275; 23 2.938,2.925; 24 2.938,3.575
SO14 = smd 0.66 x 2.032: 1 -3.81,-3.073; 2 -2.54,-3.073; 3 -1.27,-3.073; 4 0,-3.073; 5 1.27,-3.073; 6 2.54,-3.073; 7 3.81,-3.073; 8 3.81,3.073; 9 2.54,3.073; 10 1.27,3.073; 11 0,3.073; 12 -1.27,3.073; 13 -2.54,3.073; 14 -3.81,3.073
SC70-5 = smd 0.4 x 0.7: 1 -0.65,-0.85; 2 0,-0.85; 3 0.65,-0.85; 4 0.65,0.85; 5 -0.65,0.85
GCT_USB4056-03-A_REVA2 = smd 0.3 x 0.9: A1 -2.75,6.2; A2 -2.25,6.2; A3 -1.75,6.2; A4 -1.25,6.2; A5 -0.75,6.2; A6 -0.25,6.2; A7 0.25,6.2; A8 0.75,6.2; A9 1.25,6.2; A10 1.75,6.2; A11 2.25,6.2; A12 2.75,6.2 | drill 0.4 pad 0.6: B1 2.8,4.99; B2 2.4,4.29; B3 1.6,4.29; B4 1.2,4.99; B5 0.8,4.29; B6 0.4,4.99; B7 -0.4,4.99; B8 -0.8,4.29; B9 -1.2,4.99; B10 -1.6,4.29; B11 -2.4,4.29; B12 -2.8,4.99 | drill 0.5 pad 0.8: S1 -4.13,4.4; S2 4.13,4.4; S3 -4.49,0; S4 4.49,0 | hole 0.65: 3.6,5.64; -3.6,5.64
MOLEX_0483930003 = drill 0.7: 1 -3.5,4.625; 2 -1,4.625; 3 1,4.625; 4 3.5,4.625; 5 4,6.125; 6 2,6.125; 7 0,6.125; 8 -2,6.125; 9 -4,6.125 | drill 0.6 pad 1.3 long: S1 -6.4,5.375; S2 6.4,5.375; S3 -6.4,-3.125; S4 6.4,-3.125
SUPER-SOT3 = smd 1 x 1.4: 1 -0.95,-1.1; 2 0.95,-1.1; 3 0,1.1
0207/10 = drill 0.813 octagon: 1 -5.08,0; 2 5.08,0
R0805 = smd 1.3 x 1.5: 1 -0.95,0; 2 0.95,0
B3F-10XX = drill 1.016 long: 1 -3.251,2.261; 2 3.251,2.261; 3 -3.251,-2.261; 4 3.251,-2.261
TL3XPO = drill 1.1 pad 1.422 long: 1 -2.54,0; 2 0,0; 3 2.54,0
SC59-BEC = smd 1 x 1.4: B -0.95,-1.2; C 0,1.2; E 0.95,-1.2
SOIC127P599X175-8N = smd 1.97 x 0.6: 1 -2.47,1.905; 2 -2.47,0.635; 3 -2.47,-0.635; 4 -2.47,-1.905; 5 2.47,-1.905; 6 2.47,-0.635; 7 2.47,0.635; 8 2.47,1.905
SOT65P210X110-6N = smd 1.118 x 0.356: 1 -0.965,0.66; 2 -0.965,0; 3 -0.965,-0.66; 4 0.965,-0.66; 5 0.965,0; 6 0.965,0.66
SOIC127P600X175-14N = smd 1.702 x 0.533: 1 -2.591,3.81; 2 -2.591,2.54; 3 -2.591,1.27; 4 -2.591,0; 5 -2.591,-1.27; 6 -2.591,-2.54; 7 -2.591,-3.81; 8 2.591,-3.81; 9 2.591,-2.54; 10 2.591,-1.27; 11 2.591,0; 12 2.591,1.27; 13 2.591,2.54; 14 2.591,3.81
SOT95P280X145-5N = smd 1.21 x 0.59: 1 -1.255,0.95; 2 -1.255,0; 3 -1.255,-0.95; 4 1.255,-0.95; 5 1.255,0.95

### Placement (x,y rotation side)
C1  71.38,74.95 0 top
C2  79.09,84.31 0 top
C3  60.43,90.93 90 top
C4  67.35,94 0 top
C5  9.17,79.22 270 top
C6  36.33,72.73 90 bottom
C7  45.77,59.92 270 bottom
C8  15.03,77.33 90 top
C9  96.11,65.87 180 top
C10  57.68,83.24 180 bottom
C11  93.28,71.91 270 top
C12  20.08,79.59 90 top
C13  17.16,69.28 180 top
C14  42.29,90.72 0 top
C15  40.66,85.68 180 bottom
C16  36.91,76.58 180 top
C17  10.96,62.48 180 top
C18  24,66.8 0 top
D1  55.88,27.15 270 bottom
D2  59.68,27.24 270 bottom
D3  63.28,27.13 270 bottom
D4  66.88,27.02 270 bottom
D5  70.48,27.11 270 bottom
D6  74.28,27.2 270 bottom
D7  77.88,27.09 270 bottom
D8  81.68,26.98 270 bottom
D9  85.68,27.07 270 bottom
D10  89.4,27 270 bottom
D11  93.2,26.94 270 bottom
D12  97,27.03 270 bottom
D13  97,33.48 90 bottom
D14  93.2,33.39 90 bottom
D15  89.4,33.5 90 bottom
D16  85.8,33.41 90 bottom
D17  81.8,33.32 90 bottom
D18  78,33.43 90 bottom
D19  74.2,33.34 90 bottom
D20  70.6,33.45 90 bottom
D21  66.88,33.55 90 bottom
D22  63.28,33.46 90 bottom
D23  59.68,33.57 90 bottom
D24  55.88,33.48 90 bottom
D25  51.48,33.59 90 bottom
D26  89.96,90.72 90 top
F  92.36,79.92 180 top
GND  96.74,91.5 0 top
IC1  92.48,58.28 0 top
IC2  31.12,66.54 90 bottom
IC3  32.92,82.24 0 bottom
IC4  42.98,66.95 90 bottom
IC5  32.82,92.88 180 top
IC6  19.55,65.26 270 top
IC7  13.37,72.2 270 top
IC8  20.76,74.97 0 top
IC9  20.83,70.92 90 top
IC10  9.63,66.08 90 top
J1  14.02,2.41 0 top
J2  84.23,2.81 0 top
J3  48,7 0 top
Q1  4.45,26.3 270 top
Q2  9.85,26.27 270 top
Q3  15.65,26.36 270 top
Q4  21.05,26.39 270 top
Q5  26.41,26.44 270 top
Q6  31.81,26.61 270 top
Q7  37.21,26.62 270 top
Q8  42.61,26.85 270 top
Q9  48.01,26.68 270 top
Q10  53.41,26.71 270 top
Q11  59.01,26.74 270 top
Q12  65.01,26.77 270 top
Q13  63.63,50.56 270 bottom
Q14  58.23,50.59 270 bottom
Q15  52.83,50.62 270 bottom
Q16  47.43,50.45 270 bottom
Q17  42.03,50.48 270 bottom
Q18  36.63,50.51 270 bottom
Q19  31.03,50.34 270 bottom
Q20  25.63,50.37 270 bottom
Q21  20.25,50.16 270 bottom
Q22  15.25,50.19 270 bottom
Q23  9.65,50.02 270 bottom
Q24  4.25,50.25 270 bottom
Q25  70.65,26.68 270 top
R1  48.3,97.8 0 top
R2  64.05,97.75 0 top
R3  12.4,96.57 180 top
R4  53.53,40.97 270 top
R5  57.09,40.97 270 top
R6  60.65,41 270 top
R7  64.22,40.99 270 top
R8  67.82,41.03 270 top
R9  71.41,41.01 270 top
R10  75.02,41.03 270 top
R11  78.67,40.93 270 top
R12  82.14,41.1 270 top
R13  85.79,41.05 270 top
R14  89.31,41.05 270 top
R15  92.9,41.02 270 top
R16  64.72,54.76 270 bottom
R17  59.32,54.81 270 bottom
R18  53.97,54.71 270 bottom
R19  48.57,54.86 270 bottom
R20  43.23,54.79 270 bottom
R21  37.77,54.76 270 bottom
R22  32.17,54.71 270 bottom
R23  26.77,54.66 270 bottom
R24  21.37,54.61 270 bottom
R25  16.37,54.66 270 bottom
R26  10.67,54.61 270 bottom
R27  5.37,54.66 270 bottom
R28  96.47,41.01 270 top
R29  55.93,21.76 270 bottom
R30  59.73,21.71 270 bottom
R31  63.33,21.66 270 bottom
R32  66.93,21.61 270 bottom
R33  70.58,21.51 270 bottom
R34  74.18,21.46 270 bottom
R35  77.98,21.41 270 bottom
R36  81.78,21.36 270 bottom
R37  85.58,21.31 270 bottom
R38  89.38,21.26 270 bottom
R39  93.18,21.21 270 bottom
R40  96.98,21.16 270 bottom
R41  97.02,38.89 90 bottom
R42  93.22,38.94 90 bottom
R43  89.42,38.99 90 bottom
R44  85.82,39.04 90 bottom
R45  81.82,39.09 90 bottom
R46  78.02,39.14 90 bottom
R47  74.22,39.19 90 bottom
R48  70.57,39.09 90 bottom
R49  66.77,39.14 90 bottom
R50  63.37,39.19 90 bottom
R51  59.77,39.24 90 bottom
R52  55.97,39.29 90 bottom
R53  51.37,39.14 90 bottom
S1  5.89,86.91 270 top
S3  69.8,84.05 180 top
S4  18.95,94.27 90 top
T1  9.19,93.77 270 top
U1  52.54,91.95 90 top
U2  33.69,73.94 90 bottom
U3  47.71,79.47 90 bottom
U4  88.07,71.97 0 top
VCC  96.74,84.76 0 top

### Tracks (layer width: path | path; a pad name or v marks a point on that pad's centre or on a via)
GND  (via drill 0.35)
  Bottom 0.254: 27.6,63.66 IC2.12
  other vias: 89.18,53.26 39.32,75.06 33.72,71.66 39.18,87.98 43.76,85.78 41.3,94.34 5.54,80.54 5.52,79.3 5.52,77.92 17.48,76.74 20.12,82.94 93.56,92.84 93.56,91.92 93.54,90.98 93.52,90.08 8.14,58.02 14.16,58.02 19.18,58.02 24.44,57.98 29.9,57.94 34.42,57.94 40.3,57.98 51.5,57.86 57.24,57.78 62.9,57.94 52.36,45.7 56.66,45.1 59.1,44.62 45.44,48.22 34.98,46.96 27.26,47.32 17.76,47.38 6.32,47.44 10.6,47.38 34.3,49.06 59.44,72.1 60.3,71.38 61.14,70.54 58.34,68.48 81.24,53.26 82.58,53.24 77.78,48.36 76.46,48.32 39.28,14.32 11.6,3.74 8.04,22.34 15.78,30.8 19.66,30.6 26.64,30.78 30.8,30.72 34.04,29.44 19.44,10.46 62.86,88.14 61.26,34.62 66.22,36.2 68.92,36.16 76.66,36.2 73.2,43.22 80.5,36.18 84.3,36.22 86.92,36.22 95.22,36.18 91.7,36.22 98.66,36.12 64.42,24.26 57.18,28.78 58.7,24.6 57.74,22.62 54.58,24.2 50.58,28.78 50.82,23.04 45.12,29.24 41.34,29.68 15.44,21.98 17.68,19.82 12.98,25.02 17.52,25.16 16.42,20.86 50.48,25.4 83.92,3.94 84.84,3.94 45.08,25.7 39.88,26 34.6,25.72
  pour Top (isolate 0.254): -1,100.6 -1,-0.8 101.4,-0.8 101.4,101.4 101.2,101.6 -1,101.6
  pour Route2 (isolate 0.254): -0.6,103.2 -0.6,-1.8 -0.2,-2.2 100.8,-2.2 100.8,103.4 -0.4,103.4
  pour Route15 (isolate 0.254): -1.4,104 -1.4,-2.8 -1,-3.2 101,-3.2 102.6,-1.6 102.6,103.6 99.8,106.4 1,106.4
  pour Bottom (isolate 0.254): -1.2,107.2 -1.2,-2.2 -0.6,-2.8 101.8,-2.8 102.2,-2.4 102.2,104.4 98.2,108.4 0,108.4
N$1
  Top 0.254: R4.2 53.53,35.62 51.15,33.24 9.34,33.24 Q1.1
N$2
  Top 0.254: R5.2 57.09,35.62 54.3,32.83 14.36,32.83 Q2.1
N$3  (via drill 0.35)
  Top 0.254: IC10.4 9.6,65.91 9.6,64.6 10.6,63.6 37,63.6 v37.4,63.2
  Bottom 0.254: IC4.4 40.85,66.95 41.4,66.4 41.4,63.6 40.94,63.14 IC4.1 39.85,63.2 v37.4,63.2
N$4  (via drill 0.35)
  Top 0.254: 95.8,57.95 IC1.18 | IC1.18 IC1.19 | IC1.18 93.44,57.95 92,59.4 92,62.4 88,66.4 88,71.6 87.63,71.97 U4.2 65.83,71.97 v47.8,90 | IC7.1 12.52,79.12 26.77,93.37 33.06,93.37 34.09,94.4 IC5.3 34.2,96.06 v34.2,97.6
  Bottom 0.254: v34.2,97.6 40.2,97.6 v47.8,90
N$5  (via drill 0.35)
  Top 0.254: v33,77.2 31.4,77.2 30,75.8 30,67.8 26.81,64.61 IC6.4
  Bottom 0.254: IC3.1 36.73,81.27 35.8,82.2 33.6,82.2 32.92,81.52 IC3.4 33,79.09 v33,77.2
N$6  (via drill 0.35)
  Top 0.254: v18.4,72.2 19.03,71.57 IC9.4
  Route2 0.254: v18.4,72.2 18.4,73.8 19.6,75 23.6,75 29.7,81.1 29.8,81.2 v29.8,82.4
  Bottom 0.254: IC3.8 29.2,85.22 29.2,83.8 30.2,82.8 | IC3.11 33,85.23 33,83.8 32,82.8 30.2,82.8 | 30.2,82.8 v29.8,82.4
N$7  (via drill 0.35)
  Top 0.254: IC8.4 21.41,76.61 v21.6,76.8 | v32.8,94 32.82,94.02 IC5.4 32.82,98.02 33.4,98.6 36,98.6 36.63,97.97 IC5.1
  Route2 0.254: v32.8,94 31.6,92.8 27.2,92.8 21.6,87.2 v21.6,76.8
N$8
  Top 0.508: VCC.1 96.74,82.88 F.1
N$9
  Top 0.508: S3.3 67.26,77.8 C1.1
N$10
  Top 0.254: C3.2 60.15,91.6 | 50.63,93.36 U1.8
  Top 0.508: 60.15,91.6 52.4,91.6 50.63,93.36 | U1.8 46.6,94.42 R1.1
N$11  (via drill 0.35)
  Top 0.152: 10.92,26.3 Q2.3 | 16.66,26.27 Q3.3 | Q4.3 | 27.46,26.39 Q5.3 | 32.74,26.44 Q6.3 | Q7.3 | 43.49,26.63 43.66,26.8 Q8.3 | 48.94,26.85 Q9.3 49.14,26.71 | 54.54,26.74 Q10.3 | 71.66,26.77 Q25.3
  Top 0.254: C18.1 22.16,65.91 IC6.5 | C9.1 97.4,65.53 | 96.06,61.85 IC1.24 | U4.5 93.22,72.92 C11.1 | IC8.5 20.08,75.85 20.08,78.5 C12.1 | IC10.5 8.78,63.71 C17.2 | C13.1 19.1,70.27 IC9.5 | C8.1 15.03,73.66 IC7.5 | IC5.14 40.43,89.81 C14.1 | v56.2,80.4 56.2,69 v48.6,61.4 | 54.46,89.46 U1.4 54.55,89.38 | 59.93,89.48 C3.1
  Top 0.508: v39.8,29 39.8,28.11 Q7.3 38.49,26.8 43.66,26.8 | 97.4,65.53 97.4,63.2 96.06,61.85 | C9.1 96.74,66.19 96.74,74.68 94.4,77.02 92.8,77.02 | v56,88.2 55.73,88.2 U1.4 59.93,89.48 | C14.1 41.34,89.86 42.4,88.8 47.6,88.8 v49,87.4 56,80.4 v56.2,80.4 | v72.8,67.6 72.8,62.2 | 72.8,62.2 72.8,55.4 67.8,50.4 v66.4,50.4 | 72.8,62.2 66.4,55.8 13,55.8 9.8,59 9.8,59.4 | 9.8,59.4 9.8,62.27 C17.2 | 9.8,59.4 7.4,61.8 7.4,67.2 | 7.4,67.2 7.4,75.2 v8.4,76.2 9.8,76.2 11,77.4 11,91.8 10.39,92.41 T1.C 10.42,93.8 v12.4,93.8 | C8.1 13.58,76.38 v13.4,76.2 13.4,78.94 14.6,80.14 15.82,80.14 17.46,78.5 20.08,78.5 | C13.1 18.23,69.4 v20,69.4 20.45,69.4 C18.1 | v9.6,69.4 7.4,67.2 | 92.8,77.02 90.44,77.02 89.34,78.12 89.34,78.7 90.56,79.92 | 90.56,79.92 90.7,79.92 | F.2 90.7,79.92 | 90.56,79.92 88.6,79.92 v88.26,80.26 | D26.C 89.96,80.66 90.7,79.92 | 92.8,77.02 93.22,76.6 93.22,72.92 | 20.11,78.61 C12.1 | v39,73.8 38.3,73.8 36.58,75.52 36.58,75.96 C16.2 35.78,76.4 v33.8,76.4 | Q1.3 10.92,26.3 | Q2.3 11.04,26.36 Q3.3 22.12,26.36 Q4.3 | Q4.3 27.46,26.39 | Q5.3 29.75,26.44 29.85,26.54 32.84,26.54 Q6.3 Q7.3 | Q8.3 45.95,26.85 46.05,26.75 49.1,26.75 49.14,26.71 | Q9.3 54.48,26.68 54.54,26.74 | Q10.3 60.08,26.71 Q11.3 66.08,26.74 Q12.3 68.67,26.77 68.69,26.75 71.68,26.75 Q25.3
  Route2 0.508: v39,48 39.8,47.2 v39.8,29 | v72.8,67.6 80.6,75.4 83.4,75.4 v88.26,80.26 | v20,69.4 v9.6,69.4 | S4.3 15.94,93.8 v12.4,93.8
  Bottom 0.254: Q21.3 19.12,50.19 19.29,50.36 | 29.9,50.37 Q19.3 | 35.36,50.34 Q18.3 35.56,50.48 | 40.9,50.51 Q17.3 40.96,50.45 | Q16.3 46.3,50.48 46.3,56.9 47.6,58.2 47.6,60.87 | 57.1,50.62 Q14.3 | 62.5,50.59 Q13.3 | IC2.24 36.2,69.48 36.33,69.61 C6.1 | U3.14 52.7,83.24 56.6,83.24 C10.1 | 45.53,60.87 C7.1 | C7.1 45.77,62.86 IC4.14 | IC3.14 37.1,85.68 39.6,85.68 C15.1 39.71,86.11 | U2.5 33.69,76.29 v33.8,76.4 | C7.1 47.6,60.87 | 47.6,60.87 48.07,60.87 v48.6,61.4 | 13.98,50.02 Q22.3 14.18,50.16 | 24.56,50.34 Q20.3 | 8.72,50.19 Q23.3 | 51.56,50.45 Q15.3 | 41.21,87.29 41.32,87.4
  Bottom 0.508: v39,48 40.93,49.93 Q17.3 35.56,50.48 | Q15.3 57.1,50.62 | Q14.3 62.5,50.59 | 40.96,50.45 Q16.3 51.56,50.45 | Q19.3 24.56,50.34 | 14.18,50.16 Q21.3 24.32,50.16 Q20.3 | 39.6,85.68 41.21,87.29 | Q18.3 35.39,50.37 29.9,50.37 | Q24.3 8.32,50.25 Q23.3 13.98,50.02 | v56.2,80.4 59,80.4 | 59,80.4 62.8,80.4 | 62.8,80.4 60.8,82.4 60.8,84.6 57.2,88.2 v56,88.2 | 41.32,87.4 47.2,87.4 | 47.2,87.4 v49,87.4 | Q13.3 66.24,50.56 v66.4,50.4 | v13.4,76.2 v8.4,76.2 | 47.2,87.4 43.6,83.8 42.4,83.8 41.6,83 41.6,74.8 40.6,73.8 | 59,80.4 56.6,82.8 56.6,83.24 | C6.1 38.58,71.78 40.6,73.8 | 40.6,73.8 v39,73.8 | v88.26,80.26 88.12,80.4 62.8,80.4
N$12
  Top 0.254: R1.2 53.38,97.58 | 58.92,97.8 R2.1
  Top 0.508: U1.7 51.91,96.11 53.38,97.58 | R1.2 58.92,97.8
N$13
  Top 0.508: U1.5 55.02,95 65.08,95 C4.1
N$14
  Top 0.508: S3.1 77.56,84.05 C2.1
N$15
  Top 0.508: 67.05,86.8 53,86.8 51.91,87.89 U1.2 | U1.6 53.17,93.03 53.6,92.6 56.4,92.6 57.2,93.4 62,93.4 63.8,91.6 63.8,90.05 67.05,86.8 | R2.2 69.8,97.08 69.8,85.58 | S3.2 69.8,85.32 69.8,85.58 | 67.05,86.8 68.58,86.8 69.8,85.58
N$16  (via drill 0.35)
  Top 0.254: 34.2,89.7 IC5.12 34.09,88.11 v34.2,88 34.2,82.6 44.8,72 48.4,72 49.6,70.8 v49.6,69.8 | U1.3 53.17,88.22 v53.8,87.6
  Route2 0.254: v53.8,87.6 53.8,72.6 v53,71.8
  Bottom 0.254: IC4.12 46.13,65.6 48.4,65.6 49.4,66.6 49.4,68.6 48.51,69.49 | IC4.9 48.51,69.49 | IC3.9 30.38,86.98 31.4,88 v34.2,88 34.2,85.32 IC3.12 | v49.6,69.8 49.29,69.49 | 49.29,69.49 48.51,69.49 | v53,71.8 50.69,69.49 49.91,69.49 | 49.91,69.49 49.6,69.49 | 49.6,69.49 49.29,69.49 | v49.6,69.8 49.91,69.49 | v49.6,69.8 49.6,69.49
N$17
  Top 0.254: 8.25,94.98 T1.B 9.84,96.57 R3.2
N$18  (via drill 0.35)
  Top 0.254: v48.4,67.8 48.4,64.6 v48,64.2 | 35.4,89.77 IC5.13 35.36,88.04 v35.4,88 | T1.E 8.15,92.66 S1.1 9.17,89.14 C5.1
  Route2 0.254: v32,87.2 34.8,87.2 35.4,87.8 v35.4,88 | v40.4,78 48.4,70 v48.4,67.8
  Bottom 0.254: IC4.10 47.38,68.22 | 47.4,68.2 47.38,68.22 | 47.38,68.22 47.98,68.22 v48.4,67.8 | IC4.13 47.79,64.41 v48,64.2 | IC3.10 31.65,86.85 v32,87.2 | v40.4,78 40.4,78.8 35.46,83.74 IC3.13 35.4,85.37 v35.4,88 35.4,88.6 34.2,89.8 19.4,89.8 19,89.8 8.51,89.8 S1.1
N$20
  Top 0.254: IC1.2 84,61.2 68.39,45.6 59,45.6 57.09,43.69 R5.1
N$21
  Top 0.254: R3.1 15.65,94.27 S4.2
N$22  (via drill 0.35)
  Top 0.254: R14.1 89.31,43.49 87.91,44.89 87.91,54.43 88.83,55.35 IC1.11 91.16,55.35 v91.4,55.6
  Route2 0.254: v77.2,65 82,65 v91.4,55.6
  Route15 0.254: S4.1 19.82,92.6 42.31,92.6 47.65,87.25 47.94,86.97 69.91,65 v77.2,65
N$23  (via drill 0.35)
  Top 0.254: IC10.2 12.08,66.08 v12.2,66.2
  Bottom 0.254: IC3.6 30.38,78.18 23.2,71 18,71 13.2,66.2 v12.2,66.2
N$24  (via drill 0.35)
  Top 0.254: IC1.22 94.44,60.55 94,61 v94,63.6 | v37,68.4 37.2,68.6 50.4,68.6 50.8,69 50.8,78 v50.2,78.6 | v19.6,65.2 18.76,65.2 IC6.2
  Bottom 0.254: U2.3 33.03,70.97 33.4,70.61 IC2.22 33.4,68.41 34.2,67.6 | v37,68.4 38.4,68.4 | 38.4,68.4 39.73,68.4 IC4.5 | 38.4,68.4 37.6,67.6 34.2,67.6 | U3.2 50.25,78.55 v50.2,78.6 79,78.6 v94,63.6 | 34.2,67.6 33.8,67.6 31.83,65.63 28.43,65.63 28,65.2 v19.6,65.2
N$25  (via drill 0.35)
  Top 0.254: IC1.23 96.8,61.2 97.2,61.6 v97.2,61.8 | v35.6,68.4 38,66 v38,65.8 | IC6.1 17.09,65.91 v17,66
  Route2 0.254: v35.6,68.4 32.69,68.4 32.46,68.63 19.63,68.63 v17,66
  Route15 0.254: v52.8,76.4 67.4,61.8 v97.2,61.8 | v38,65.8 39.8,67.6 v43.4,67.6
  Bottom 0.254: U2.1 34.55,72.78 34.55,71.15 34,70.6 34,69.52 IC2.23 34.05,68.56 34.2,68.4 v35.6,68.4 | 44.4,67.8 44.4,70 45.16,70.76 IC4.8 48.16,70.76 51.52,74.12 U3.1 52.32,76.88 v52.8,76.4 | 44.4,67.8 45.25,66.95 IC4.11 | IC4.3 38.12,65.68 v38,65.8 | v43.4,67.6 43.6,67.8 44.4,67.8
N$26  (via drill 0.35)
  Top 0.254: U4.4 90,70.34 v90,69.4
  Route2 0.254: v32.2,68 32.2,67.2 32.8,66.6 89,66.6 90,67.6 v90,69.4
  Bottom 0.254: IC2.18 IC2.19 31.45,68.56 32,68 v32.2,68
N$27  (via drill 0.35)
  Top 0.254: IC10.1 11.97,65.43 v12.2,65.2 | IC5.2 35.36,92.36 v34.4,91.4
  Route15 0.254: v12.2,65.2 13.6,65.2 15.6,67.2 22.8,67.2 24.6,69 24.6,81.6 v34.4,91.4
N$28
  Top 0.254: IC8.2 20.8,74.08 20.8,71.4 | 20.8,71.4 21.28,70.92 IC9.2 | 20.8,71.4 20.72,71.4 20.32,71 18.2,71 17.65,71.55 IC7.4
N$29  (via drill 0.35)
  Top 0.254: IC9.1 23.13,70.27 v23.2,70.2
  Route2 0.254: v32.8,76.2 26.8,70.2 v23.2,70.2
  Bottom 0.254: v32.8,76.2 33.03,75.97 U2.4
N$30  (via drill 0.35)
  Top 0.254: IC1.21 93.89,59.91 93.2,60.6 v93.2,63
  Route2 0.254: v54,69.2 v47.8,75.4 47.8,78.2 45,81 v34.2,81
  Bottom 0.152: 32.8,69.53 IC2.21
  Bottom 0.254: 32.8,69.53 32.8,70.6 32.4,71 32.4,73.6 32.8,74 34.2,74 34.35,74.15 U2.6 34.55,75.11 34.55,76.65 34.19,77.01 IC3.3 v34.2,81 | v93.2,63 60.2,63 v54,69.2 | U3.4 47.71,75.49 v47.8,75.4
N$31  (via drill 0.35)
  Top 0.254: v92.8,59.8 93.34,59.26 IC1.20 | v33.4,83.2 29,83.2 25.4,79.6 25.4,77.4 23,75 18,75 15.2,72.2 IC7.2
  Route15 0.254: v92.8,59.8 92.8,60.6 92.2,61.2 60.2,61.2 v47.2,74.2 38.2,83.2 v33.4,83.2
  Bottom 0.254: U3.5 46.44,74.96 v47.2,74.2 | IC2.20 32.09,70.7 31.89,70.91 31.89,75.5 31.65,75.75 IC3.5 31.65,81.45 v33.4,83.2
N$32  (via drill 0.35)
  Top 0.254: IC8.1 20.11,73.31 v20,73.2
  Route2 0.254: v45.2,78.8 31.8,78.8 26.2,73.2 v20,73.2
  Bottom 0.254: v45.2,78.8 45.2,76.91 U3.6
N$33
  Top 0.254: IC1.1 83.6,61.85 68.14,46.4 56.4,46.4 53.53,43.53 R4.1
N$34
  Top 0.254: IC1.3 84.4,60.55 77.22,53.38 77,53.16 68.84,45 62,45 60.65,43.65 R6.1
N$35
  Top 0.254: IC1.4 84.6,59.91 77.8,53.1 69.09,44.4 65.2,44.4 64.2,43.4 64.2,41.96 R7.1
N$36
  Top 0.254: R8.1 85.09,59.26 IC1.5
N$37
  Top 0.254: 71.83,41.96 R9.1 71.41,43.01 72.6,44.2 79.2,44.2 85.64,50.64 85.64,57.04 87.2,58.6 IC1.6
N$38
  Top 0.254: IC1.7 87.44,57.95 86.28,56.8 86.28,53.4 86.28,53.24 86.28,50.28 79.6,43.6 76,43.6 75,42.6 75,42 R10.1
N$39
  Top 0.254: R11.1 86.69,49.9 86.69,56.09 87.91,57.3 IC1.8
N$40
  Top 0.254: R12.1 82.14,44.64 87.09,49.59 87.09,55.29 88.45,56.66 IC1.9
N$41
  Top 0.254: R13.1 85.79,44.29 87.5,46 87.5,54.8 88.7,56.01 IC1.10
N$42
  Top 0.254: R15.1 95.42,44.49 IC1.13
N$43  (via drill 0.35)
  Top 0.254: IC1.14 93.25,55.35 91.2,57.4 v91.2,58.4
  Bottom 0.254: 65,55.99 R16.1 64.72,57.52 65.4,58.2 91,58.2 v91.2,58.4
N$44  (via drill 0.35)
  Top 0.254: IC1.15 97.41,56.01 98,56.6 98,59 v97.8,59.2
  Bottom 0.254: 59.4,55.84 R17.1 59.32,58.26 60.2,59.14 93.27,59.14 93.33,59.2 v97.8,59.2
N$45  (via drill 0.35)
  Top 0.254: IC1.16 93.94,56.66 91.2,59.4 v91.2,59.8
  Bottom 0.254: 54,55.69 R18.1 53.97,58.37 55.4,59.8 v91.2,59.8
N$46  (via drill 0.35)
  Top 0.254: IC1.17 96.31,57.3 96.8,57.8 96.8,59.6 v97.8,60.6
  Bottom 0.254: R19.1 48.6,55.84 48.6,58.4 50.8,60.6 v97.8,60.6
N$47
  Bottom 0.254: IC2.1 34.7,61.7 36.4,60 38.6,60 39.4,60 41.8,60 43.23,58.57 R20.1
N$48  (via drill 0.35)
  Top 0.254: R28.1 96.2,42.23 v96.2,46.4
  Route2 0.254: v96.2,46.4 85.6,46.4 67,65 v29.6,65
  Bottom 0.254: IC2.9 29.5,64.89 v29.6,65
N$49
  Bottom 0.254: 37.6,55.88 37.64,55.84 | 37.64,55.84 R21.1 | IC2.2 34.05,59.76 34.8,59 37,59 37.8,58.2 37.8,56 37.64,55.84
N$50
  Bottom 0.254: R22.1 32.2,55.69 32,55.89 32,59.2 33.4,60.59 IC2.3
N$51
  Bottom 0.254: 26.8,55.64 R23.1 26.77,56.97 28,58.2 28.3,58.5 29.2,59.4 30.8,59.4 32.74,61.34 IC2.4
N$52
  Bottom 0.254: R24.1 21.4,55.59 21.4,57.6 22.8,59 27.8,59 29,60.2 30.2,60.2 32.09,62.09 IC2.5
N$53
  Bottom 0.254: 16.6,55.84 R25.1 | R25.1 | IC2.6 31.45,62.24 30.2,61 28.6,61 27.2,59.6 17.4,59.6 16.38,58.58 R25.1
N$54
  Bottom 0.254: 10.8,55.69 R26.1 10.67,58.27 12.6,60.2 26.8,60.2 28.01,61.41 29.8,61.41 30.8,62.4 IC2.7
N$55
  Bottom 0.254: IC2.8 30.14,62.74 29.4,62 27.6,62 26.4,60.8 7,60.8 5.37,59.17 R27.1
N$56
  Top 0.254: R6.2 60.65,35.65 57.43,32.43 19.67,32.43 Q3.1
N$57
  Top 0.254: R7.2 64.22,35.64 60.6,32.02 24.63,32.02 Q4.1
N$58
  Top 0.254: R8.2 67.82,35.68 63.75,31.61 29.53,31.61 Q5.1
N$59
  Top 0.254: R9.2 71.41,35.66 66.96,31.21 34.36,31.21 Q6.1
N$60
  Top 0.254: R10.2 75.02,35.68 70.14,30.8 39.34,30.8 Q7.1
N$61
  Top 0.254: R11.2 78.67,35.58 73.42,30.33 44.04,30.33 Q8.1
N$62
  Top 0.254: R12.2 82.14,35.75 76.32,29.93 49.21,29.93 Q9.1
N$63
  Top 0.254: R13.2 85.79,35.7 79.61,29.52 54.17,29.52 Q10.1
N$64
  Top 0.254: R14.2 89.31,35.7 82.72,29.11 59.33,29.11 Q11.1
N$65
  Top 0.254: R15.2 92.9,35.67 85.94,28.71 64.9,28.71 Q12.1
N$66
  Bottom 0.254: R16.2 Q13.1
N$67
  Bottom 0.254: R17.2 Q14.1
N$68
  Bottom 0.254: R18.2 53.97,51.61 Q15.1
N$69
  Bottom 0.254: R19.2 48.57,51.44 Q16.1
N$70
  Bottom 0.254: R20.2 43.23,51.53 Q17.1
N$71
  Bottom 0.254: R21.2 37.77,51.5 Q18.1
N$72
  Bottom 0.254: R22.2 32.17,51.33 Q19.1
N$73
  Bottom 0.254: R23.2 26.77,51.36 Q20.1
N$74
  Bottom 0.254: R24.2 21.37,51.13 Q21.1
N$75
  Bottom 0.254: R25.2 16.37,51.16 Q22.1
N$76
  Bottom 0.254: R26.2 10.75,53.58 Q23.1
N$77
  Bottom 0.254: 5.35,53.69 R27.2 5.37,51.22 Q24.1
N$78
  Top 0.254: R28.2 96.47,35.66 89.11,28.3 70.2,28.3 69.55,27.65 Q25.1
N$80
  Bottom 0.254: D1.A 55.88,22.76 R29.1
N$81  (via drill 0.35)  (1 unrouted)
  Top 0.152: 16.8,8.64 J1.A12 16.77,8.97 | 3.1,25.1 Q1.2
  Top 0.254: J1.A12 16.77,11.67 26.7,21.6 59.69,21.6 Q12.2 | J1.A1 11.27,17.43 Q1.2 4.85,25.35 v5.2,25
  Route2 0.254: J3.1 43.88,12.24 43.63,12.24 31.68,24.2 6.2,24.2 5.4,25 v5.2,25
N$82  (1 unrouted)
  Bottom 0.254: J1.B1 16.42,7.4 16.2,7.62 16.2,9.46 32.55,25.81 33.21,25.81 51,43.6 59.2,43.6 64.73,49.13 Q13.2 | J1.B12 11.8,7.4 12.2,7.8 12.2,20.17 11.59,20.78 11.59,39.51 5.35,45.75 Q24.2
N$83  (via drill 0.35)
  Top 0.254: 8.75,25.16 8.75,25.2 | 8.75,25.2 Q2.2 | J1.A2 11.77,22.18 10.28,23.68 | 10.28,23.68 8.75,25.2 | v10.2,21.8 10.2,23.6 10.28,23.68
  Route2 0.254: J3.2 45.75,11.62 44.87,10.74 44.13,10.74 43.62,11.26 43.62,11.54 31.55,23.6 12,23.6 v10.2,21.8
N$84  (via drill 0.35)
  Top 0.254: J1.A3 12.27,22.2 | 12.27,22.2 12.27,23.13 Q3.2 | v13,21.8 12.67,21.8 12.27,22.2
  Route2 0.254: J3.3 48.25,11.62 46.96,10.34 41.27,10.34 28.6,23 14.2,23 v13,21.8
N$85  (via drill 0.35)  (1 unrouted)
  Top 0.254: J1.A9 15.27,13.17 25.2,23.1 44.28,23.1 Q9.2 48,24.64 v48,24.6 | J1.A4 12.77,18.27 16.55,22.05 | Q4.2 16.55,22.05 | v17.4,21.8 16.8,21.8 16.55,22.05
  Route2 0.254: J3.4 50.25,11.62 48.55,9.93 41.07,9.93 28.41,22.59 18.19,22.59 v17.4,21.8
  Bottom 0.254: J3.9 44,15.8 48,19.8 v48,24.6
N$86  (via drill 0.35)
  Top 0.254: J1.A5 13.27,16.57 18.85,22.15 | Q5.2 25.02,25.2 21.9,25.2 18.85,22.15 | v19.6,21.8 19.2,21.8 18.85,22.15
  Route2 0.254: J3.5 52.6,12.53 52.6,11 51.12,9.52 40.9,9.52 28.24,22.19 19.99,22.19 v19.6,21.8
N$87  (via drill 0.35)
  Top 0.254: J1.A6 13.77,14.67 23.7,24.6 29.65,24.6 Q6.2 | Q6.2 30.79,25.66 | v33.66,25.08 33.08,25.66 Q6.2
  Route2 0.254: v33.66,25.08 41.12,25.08 50,16.2 J3.6
N$88  (via drill 0.35)
  Top 0.254: J1.A7 14.27,14.17 24.2,24.1 35.4,24.1 36.11,24.81 Q7.2 37,24.78 v37,24.4
  Route2 0.254: J3.7 48,17.62 41.23,24.4 v37,24.4
N$89  (via drill 0.35)
  Top 0.254: J1.A8 14.77,13.67 24.7,23.6 39.21,23.6 Q8.2 42.61,24.8 v42.8,24.8
  Route15 0.254: J3.8 46,22.8 44.1,24.7 44,24.8 v42.8,24.8
N$90  (via drill 0.35)
  Top 0.254: J1.A10 15.77,12.67 25.7,22.6 49.15,22.6 Q10.2 52.8,25.27 v52.8,24.4
  Bottom 0.254: J3.S1 J3.S3 J3.S4 J3.S2 54.4,14.8 53.7,15.5 52.8,16.4 v52.8,24.4
N$91
  Top 0.254: Q11.2 54.22,22.1 26.2,22.1 16.27,12.17 J1.A11
N$92  (via drill 0.35)
  Route15 0.254: v37.7,5.4 37.7,28.6 v57.1,48
  Bottom 0.254: J1.B2 17.32,5.8 37.3,5.8 v37.7,5.4 | Q14.2 59.33,48.53 58.8,48 v57.1,48
N$93  (via drill 0.35)
  Route15 0.254: v36.6,4.6 36.6,23.87 36.34,24.13 36.34,32.54 v51.8,48
  Bottom 0.254: J1.B3 15.74,6.58 15.74,6.42 16.95,5.2 36,5.2 v36.6,4.6 | v51.8,48 53.6,48 53.93,48.33 Q15.2
N$94  (1 unrouted)
  Bottom 0.254: J1.B9 12.82,20.52 12.19,21.15 12.19,41.09 17.1,46 19.8,46 21.35,47.55 Q21.2 | J1.B4 15.22,18.68 19.35,22.81 20.01,22.81 43.8,46.6 47.8,46.6 48.53,47.33 Q16.2
N$95  (via drill 0.35)
  Route15 0.254: v36.4,41.1 35.5,40.2 v35.5,4
  Bottom 0.254: J1.B5 14.94,6.58 14.94,6.42 16.75,4.6 34.9,4.6 v35.5,4 | Q17.2 43.13,47.83 v36.4,41.1
N$96
  Bottom 0.254: J1.B6 14.42,31.42 31,48 35.2,48 35.4,48 37.2,48 37.73,48.53 Q18.2
N$97
  Bottom 0.254: J1.B7 13.82,7.6 13.82,31.92 31.29,49.39 Q19.2
N$98  (via drill 0.35)
  Route15 0.254: v34.7,3.4 34.7,20.9 25.84,29.76 22.64,32.96 22.64,46.14 v24.53,48.03
  Bottom 0.254: J1.B8 15.92,4 34.1,4 v34.7,3.4 | Q20.2 26.73,48.81 25.95,48.03 v24.53,48.03
N$99
  Bottom 0.254: D2.A 59.68,22.71 R30.1
N$100  (via drill 0.35)
  Route15 0.254: v33.3,2.8 33.3,20.5 12.06,41.74 12.06,45.96 v14.15,48.05
  Bottom 0.254: J1.B10 12.54,6.58 12.54,6.22 15.36,3.4 32.7,3.4 v33.3,2.8 | v14.15,48.05 15.16,48.05 Q22.2
N$101  (via drill 0.35)
  Route15 0.254: v32.1,1.4 32.1,19.9 7.58,44.42 7.58,47.08 v8.55,48.05
  Bottom 0.254: J1.B11 11.74,6.58 11.74,6.42 16.75,1.4 v32.1,1.4 | v8.55,48.05 9.73,48.05 Q23.2
N$102
  Bottom 0.254: D3.A 63.28,22.66 R31.1
N$103
  Top 0.254: J1.S2 19.41,6.81 20.2,7.6 20.2,14.1 27.2,21.1 64.92,21.1 Q25.2 | 9.89,2.77 J1.S3 J1.S4 18.51,6.45 J1.S2 | J1.S2 18.2,6.76
  Top 0.305: J1.S1 9.89,2.77
N$104
  Bottom 0.254: D4.A 66.88,22.61 R32.1
N$105
  Bottom 0.254: D5.A 70.48,22.56 R33.1
N$106
  Bottom 0.254: D6.A 74.28,22.51 R34.1
N$107
  Bottom 0.254: D7.A 77.88,22.46 R35.1
N$108
  Bottom 0.254: D8.A 81.68,22.41 R36.1
N$109
  Bottom 0.254: D9.A 85.68,22.36 R37.1
N$110
  Bottom 0.254: D10.A 89.4,22.23 R38.1
N$111
  Bottom 0.254: D11.A 93.2,22.18 R39.1
N$112
  Bottom 0.254: D12.A 97,22.13 R40.1
N$113
  Bottom 0.254: R41.1 97.02,34.4 D13.A
N$114
  Bottom 0.254: D14.A 93.2,37.97 R42.1
N$115
  Bottom 0.254: R43.1 89.42,34.42 D15.A
N$116
  Bottom 0.254: D16.A 85.8,38.07 R44.1
N$117
  Bottom 0.254: R45.1 81.82,34.24 D17.A
N$118
  Bottom 0.254: D18.A 78,38.17 R46.1
N$119
  Bottom 0.254: R47.1 74.22,34.26 D19.A
N$120
  Bottom 0.254: D20.A 70.57,34.38 R48.1
N$121
  Bottom 0.254: R49.1 66.88,38.08 D21.A
N$122
  Bottom 0.254: D22.A 63.28,38.15 R50.1
N$123
  Bottom 0.254: R51.1 59.77,34.56 D23.A
N$124
  Bottom 0.254: D24.A 55.88,38.25 R52.1
N$125
  Bottom 0.254: R53.1 51.48,38.08 D25.A
N$126  (via drill 0.35)  (1 unrouted)
  Top 0.254: J2.A12 86.98,9.78 87.4,10.2 89,10.2 89.6,10.8 v89.6,12.2 | J2.A1 81.48,9.72 81.2,10 79.6,10 78.6,11 v78.6,12.2
  Bottom 0.254: v89.6,12.2 90.8,13.4 94,13.4 96.98,16.38 R40.2 | v78.6,12.2 59.2,12.2 55.93,15.47 R29.2
N$127  (via drill 0.35)
  Top 0.254: J2.A2 81.98,9.82 81.39,10.41 80,10.41 79.6,10.81 v79.6,12.2
  Bottom 0.254: v79.6,12.2 79.53,12.2 78.87,12.86 60.94,12.86 59.6,14.2 59.6,20.63 R30.2
N$128  (via drill 0.35)
  Top 0.254: J2.A3 82.48,9.92 81.59,10.81 81,10.81 80.6,11.21 v80.6,12.2
  Bottom 0.254: R31.2 63.33,14.87 64.8,13.4 79.6,13.4 80.6,12.4 v80.6,12.2
N$129  (via drill 0.35)  (1 unrouted)
  Top 0.254: v86.6,12.2 86.6,11.2 85.48,10.08 J2.A9 | J2.A4 82.98,9.99 81.6,11.38 v81.6,12.2
  Bottom 0.254: v81.6,12.2 79.8,14 68.2,14 66.93,15.27 R32.2 | v86.6,12.2 85.58,13.22 R37.2
N$130  (via drill 0.35)
  Top 0.254: J2.A5 83.48,10.12 82.6,11 v82.6,12.2
  Bottom 0.254: v82.6,12.2 80.2,14.6 72,14.6 70.58,16.02 R33.2
N$131  (via drill 0.35)
  Top 0.254: J2.A6 83.98,10.22 83.6,10.6 v83.6,12.2
  Bottom 0.254: v83.6,12.2 80.6,15.2 76,15.2 74.18,17.02 R34.2
N$132  (via drill 0.35)
  Top 0.254: J2.A7 84.48,12.08 v84.6,12.2
  Bottom 0.254: v84.6,12.2 81,15.8 79.2,15.8 77.98,17.02 R35.2
N$133  (via drill 0.35)
  Top 0.254: J2.A8 84.98,10.18 85.6,10.8 v85.6,12.2
  Bottom 0.254: v85.6,12.2 81.78,16.02 R36.2
N$134  (via drill 0.35)
  Top 0.254: J2.A10 85.98,9.98 87.6,11.6 v87.6,12.2
  Bottom 0.254: v87.6,12.2 89.4,14 89.4,20.29 R38.2
N$135  (via drill 0.35)
  Top 0.254: J2.A11 86.48,9.88 87.21,10.61 88,10.61 88.6,11.21 v88.6,12.2
  Bottom 0.254: v88.6,12.2 90.4,14 92.2,14 93.18,14.98 R39.2
N$136  (via drill 0.35)  (1 unrouted)
  Route2 0.254: v70.8,11.2 54.6,27.4 54.6,42 v55.2,42.6 | v97.6,9.2 97.6,44.6 v97,45.2
  Bottom 0.254: J2.B1 86.4,8.43 86.4,8.8 87.2,9.6 97.2,9.6 v97.6,9.2 | J2.B12 82.1,8.47 82.1,9.06 81.24,9.92 80.02,9.92 79.9,9.8 77.2,9.8 75.4,11.6 71.2,11.6 v70.8,11.2 | v55.2,42.6 55.97,41.83 R52.2 | v97,45.2 97.02,45.18 R41.2
N$137  (via drill 0.35)
  Route2 0.254: v95.6,6.2 95.6,14.8 93.8,16.6 93.8,44.2 v92.8,45.2
  Bottom 0.254: J2.B2 87.73,6 95.4,6 v95.6,6.2 | v92.8,45.2 92.8,40.31 R42.2
N$138  (via drill 0.35)
  Route2 0.254: v94,4 94,15 90.6,18.4 90.6,44.2 v89.4,45.4
  Bottom 0.254: J2.B3 85.9,7.03 85.9,6.8 87.69,5 93,5 v94,4 | v89.4,45.4 89.4,39.96 R43.2
N$139  (via drill 0.35)  (1 unrouted)
  Route2 0.254: J2.B9 83.03,9.37 82,10.4 77.8,10.4 76.8,9.4 74,9.4 73.2,10.2 73.2,14.8 65.4,22.6 65.4,42.6 v66.4,43.6 | v92.4,10.6 92.4,14.4 90.6,16.2 90.4,16.4 87.8,19 87.8,43.2 v85.6,45.4
  Bottom 0.254: J2.B4 85.43,8.4 87.22,10.2 92,10.2 v92.4,10.6 | v66.4,43.6 66.77,43.23 R49.2 | v85.6,45.4 85.6,40.21 R44.2
N$140  (via drill 0.35)
  Route2 0.254: v91.6,3 91.6,13.8 87.6,17.8 83.8,17.8 83,18.6 83,46.8 v81.8,48
  Bottom 0.254: J2.B5 85.1,7.03 85.1,6.8 87.49,4.4 90.2,4.4 v91.6,3 | v81.8,48 81.8,40.06 R45.2
N$141  (via drill 0.35)
  Route2 0.254: v90.8,11.2 90.8,13.4 87.4,16.8 83,16.8 79.2,20.6 79.2,43.8 v78,45
  Bottom 0.254: J2.B6 84.63,8.18 87.65,11.2 v90.8,11.2 | v78,45 78,40.11 R46.2
N$142  (via drill 0.35)
  Route2 0.254: J2.B7 83.83,9.77 82.4,11.2 77.8,11.2 75.4,13.6 75.4,44 v74.4,45
  Bottom 0.254: v74.4,45 74.4,40.32 R47.2
N$143  (via drill 0.35)
  Route2 0.254: v74.8,10.4 74.8,14.2 71.8,17.2 71.8,43 71,43.8 v70.8,43.8
  Route15 0.254: J2.B8 83.43,6.43 81.8,4.8 77.4,4.8 74.8,7.4 v74.8,10.4
  Bottom 0.254: v70.8,43.8 70.8,40.27 R48.2
N$144  (via drill 0.35)
  Route2 0.254: v72.6,4.8 72.6,14.2 62,24.8 62,43 62.6,43.6 v62.8,43.6
  Bottom 0.254: J2.B10 82.63,6.83 81.26,5.46 73.26,5.46 v72.6,4.8 | v62.8,43.6 63.37,43.03 R50.2
N$145  (via drill 0.35)
  Route2 0.254: v71.6,6 71.6,10.6 72,11 72,13.6 58.4,27.2 58.4,42 v59,42.6
  Bottom 0.254: v71.6,6 80.73,6 J2.B11 | v59,42.6 59.77,41.83 R51.2
N$146  (via drill 0.35)
  Top 0.254: J2.S1 80.1,3.17 J2.S3 J2.S4 88.72,6.85 J2.S2
  Route2 0.254: v48.8,38 48.8,21.4 66.2,4 v69,4
  Bottom 0.254: J2.S3 70.19,2.81 v69,4 | v48.8,38 50.89,40.09 R53.2
N$147  (via drill 0.35)
  other vias: 46.86,23.7
N$157  (via drill 0.35)
  other vias: 46.52,45.58

### Text on the board
tPlace: ROCETEX | 263686
bPlace: ROCETEX | 263686 | USB TESTER | B | SHIELD | GND | TX2+ | VBUS | TX2- | CC2 | D+ | D- | SBU2 | VBUS | RX1- | RX1+ | GND | GND | RX2+ | RX2- | VBUS | SBU1 | D- | D+ | CC1 | VBUS | TX1- | TX1+ | GND | A